# EAGLE board 016-5_spdif-simple_main_revb_sch-pcb (EAGLE 7.7.0)
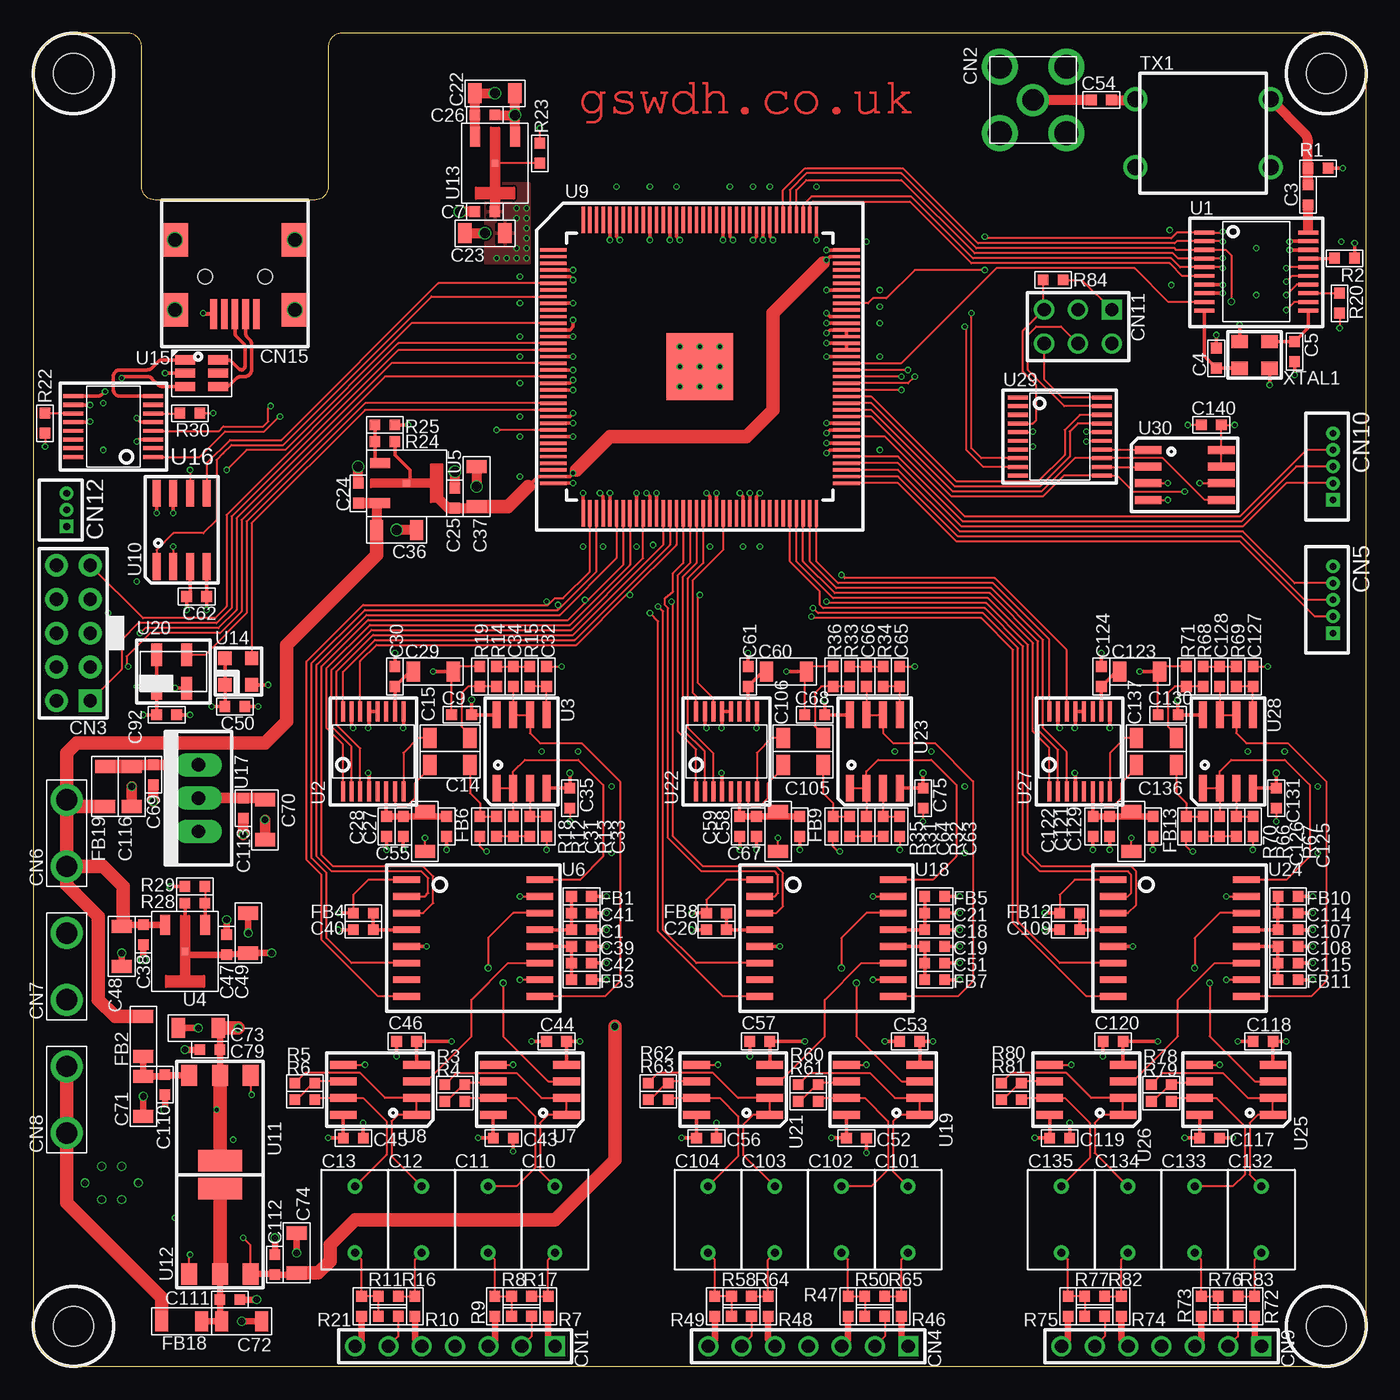
[diagram p10: board, top side]
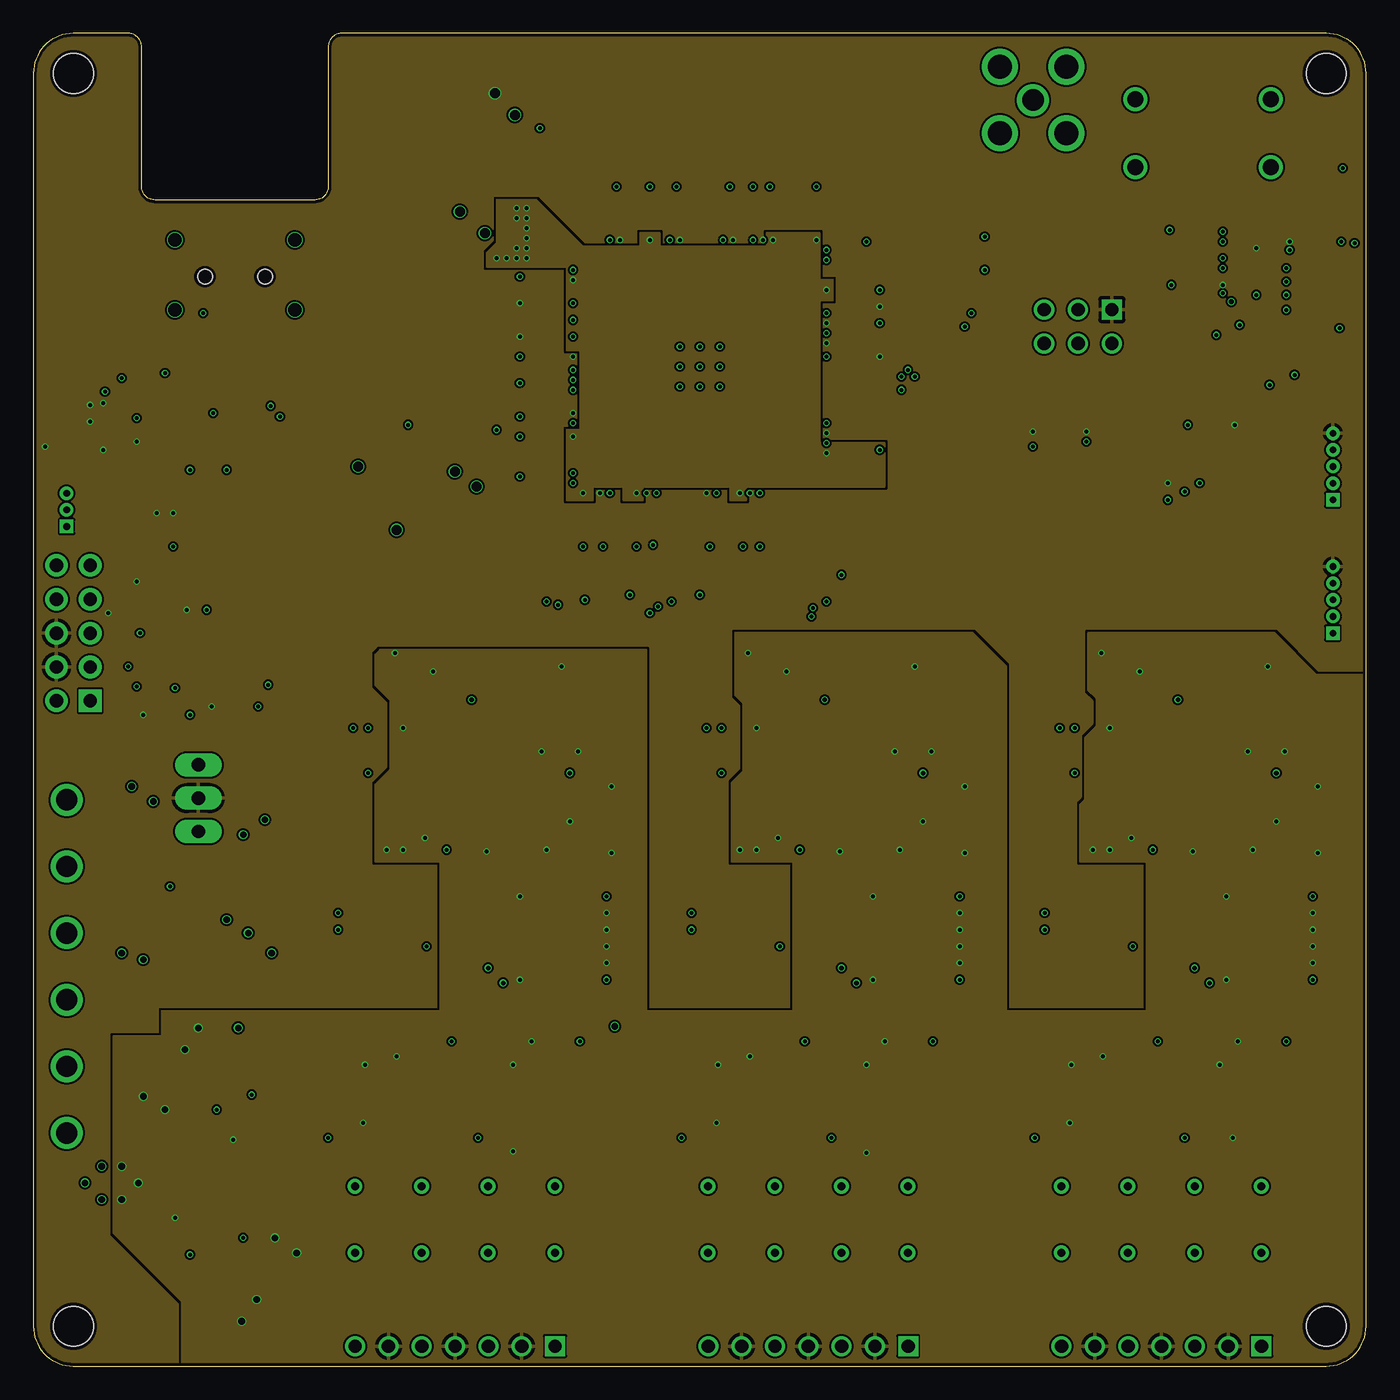
[diagram p11: board, inner layer PWR]
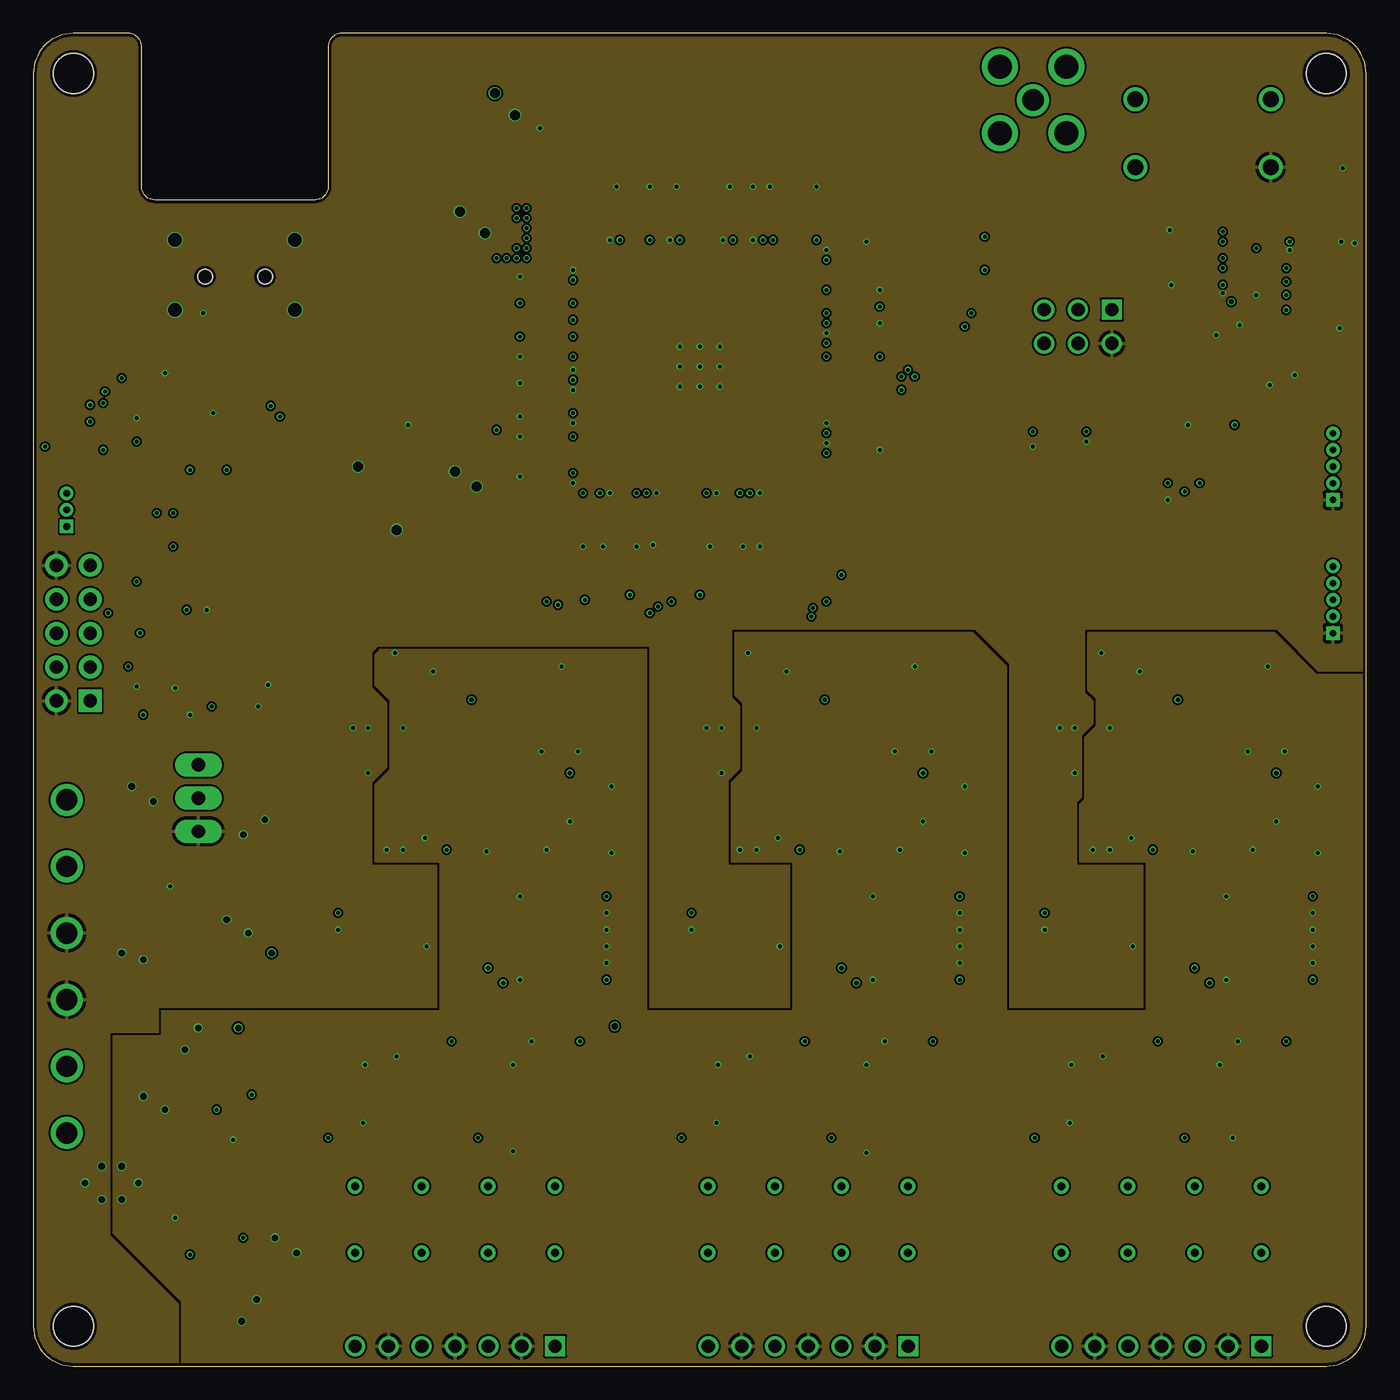
[diagram p12: board, inner layer GND]
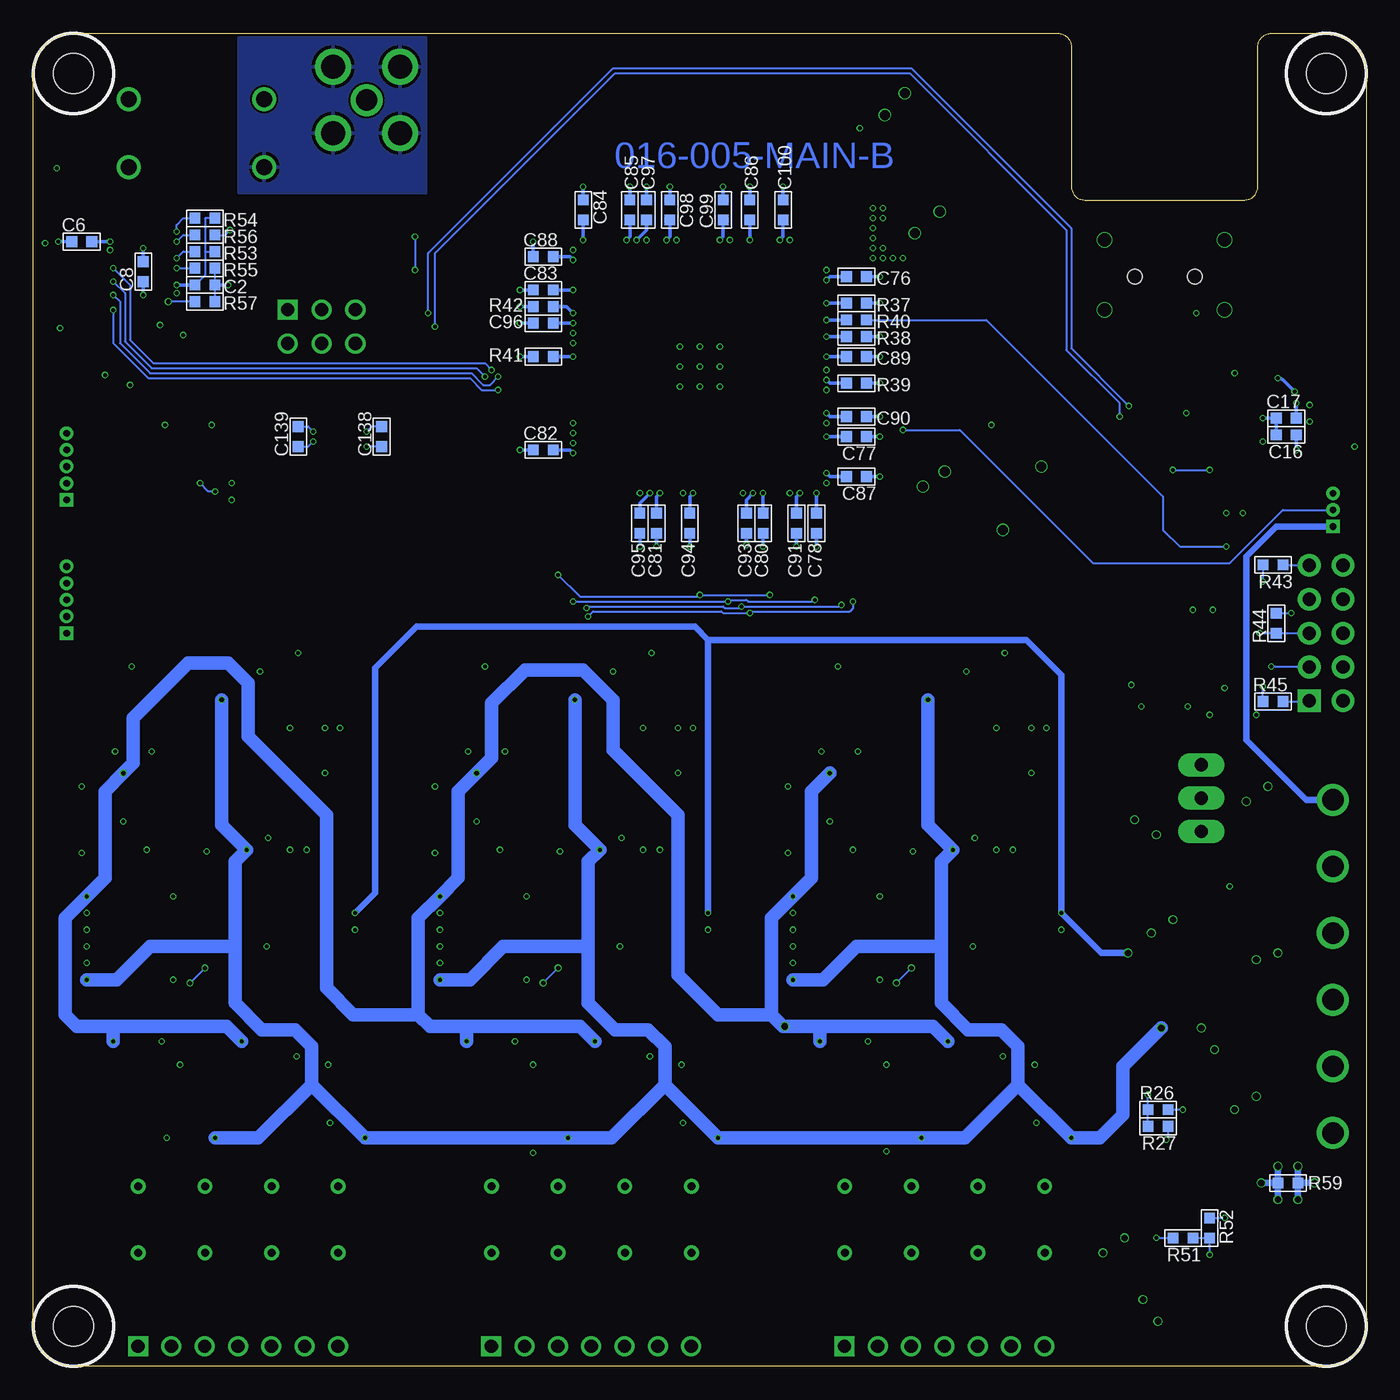
[diagram p13: board, bottom side, seen from below]

Size 100 x 100 mm. Coordinates in mm from the lower left corner, seen from the top.
Outline: 97,0 arc90 100,3 100,97 arc90 97,100 23.12,100 arc90 22.12,99 22.12,88.5 arc-90 21.12,87.5 9.12,87.5 arc-90 8.12,88.5 8.12,99 arc90 7.12,100 3,100 arc90 0,97 0,3 arc90 3,0 97,0
Copper layers (1*2*3*16): Top 0.035mm / dielectric 1.5mm / PWR 0.035mm / dielectric 0.15mm / GND 0.035mm / dielectric 0.2mm / Bottom 0.035mm
Design rules "myDRC 4 layers 0.25mm *": minimum track width 0.15mm, minimum drill 0.3mm, track to track 0.15mm, track to pad 0.15mm, pad to pad 0.15mm, via to via 0.15mm, smd to smd 0mil, copper to edge 0.25mm, drill to drill 0.3mm, minimum pad ring 10mil, minimum via ring 3mil, stop-mask expansion 4mil, vias tented up to drill 0.3mm, thermal gap 10mil

## Footprints (pad centres in the part's own frame; a part is rotated, then mirrored left to right if it is on the bottom)
0603 = smd 0.8 x 0.8: 1 -0.75,0; 2 0.75,0
5X7.2BOX = drill 0.6: 1 -2.5,0; 2 2.5,0
1206 = smd 1 x 1.5: 1 1.5,0; 2 -1.5,0
7PIN_HEADER = drill 1 pad 1.5 square: 1 0,7.52 | drill 1 pad 1.5: 2 0,5.02; 3 0,2.52; 4 0,0.02; 5 0,-2.48; 6 0,-4.98; 7 0,-7.48
SMAVERTICAL = drill 1.6: 1 0,0 | drill 1.8: 2 -2.5,2.5; 3 2.5,2.5; 4 -2.5,-2.5; 5 2.5,-2.5
5X2_2.54MMHEADER = drill 1 pad 1.7 square: 1 -1.27,5.08 | drill 1 pad 1.7: 2 -1.27,2.54; 3 -1.27,0; 4 -1.27,-2.54; 5 -1.27,-5.08; 6 1.27,-5.08; 7 1.27,-2.54; 8 1.27,0; 9 1.27,2.54; 10 1.27,5.08
MOLEX_530470510 = drill 0.5 square: 1 2.5,0 | drill 0.5: 2 1.25,0; 3 0,0; 4 -1.25,0; 5 -2.5,0
6.35MM_TERMINAL = drill 1.6: 1 -2.5,0; 2 2.5,0
2X3HEADER = drill 1 pad 1.5 square: 1 -1.27,2.54 | drill 1 pad 1.5: 2 -1.27,0; 3 -1.27,-2.54; 4 1.27,-2.54; 5 1.27,0; 6 1.27,2.54
MOLEX_530470310 = drill 0.5 square: 1 1.25,0 | drill 0.5: 2 0,0; 3 -1.25,0
MUSB-05-S-B-SM-A = smd 0.5 x 2.25: D+ 0,2.8; D- -0.8,2.8; GND 1.6,2.8; ID 0.8,2.8; VCC -1.6,2.8 | smd 2 x 2.5: SHIELD1 -4.5,2.5; SHIELD2 4.5,2.5; SHIELD3 4.5,-2.75; SHIELD4 -4.5,-2.75 | hole 1.1: 2.25,0; -2.25,0
MOUNTHOLE_6X3 = hole 3: 0,0
DA10XC = drill 1.2: 1 -5.08,2.54; 3 -5.08,-2.54; 4 5.08,-2.54; 6 5.08,2.54
SSOP20-5MM = smd 1.5 x 0.3: 1 -3.9,2.925; 2 -3.9,2.275; 3 -3.9,1.625; 4 -3.9,0.975; 5 -3.9,0.325; 6 -3.9,-0.325; 7 -3.9,-0.975; 8 -3.9,-1.625; 9 -3.9,-2.275; 10 -3.9,-2.925; 11 3.9,-2.925; 12 3.9,-2.275; 13 3.9,-1.625; 14 3.9,-0.975; 15 3.9,-0.325; 16 3.9,0.325; 17 3.9,0.975; 18 3.9,1.625; 19 3.9,2.275; 20 3.9,2.925
SSOP16-4MM@1 = smd 1.5 x 0.3: 1 -3,2.275; 2 -3,1.625; 3 -3,0.975; 4 -3,0.325; 5 -3,-0.325; 6 -3,-0.975; 7 -3,-1.625; 8 -3,-2.275; 9 3,-2.275; 10 3,-1.625; 11 3,-0.975; 12 3,-0.325; 13 3,0.325; 14 3,0.975; 15 3,1.625; 16 3,2.275
SO8 = smd 2 x 0.6: 1 -2.75,2; 2 -2.75,0.75; 3 -2.75,-0.5; 4 -2.75,-1.75; 5 2.75,-1.75; 6 2.75,-0.5; 7 2.75,0.75; 8 2.75,2
SOT89 = smd 0.75 x 1.5: 1 -1.5,-2.25; 3 1.5,-2.25 | smd 0.5 x 0.5: 2 0,-0.25
SOL16 = smd 2 x 0.5: 1 -5,4.375; 2 -5,3.125; 3 -5,1.875; 4 -5,0.625; 5 -5,-0.625; 6 -5,-1.875; 7 -5,-3.125; 8 -5,-4.375; 9 5,-4.375; 10 5,-3.125; 11 5,-1.875; 12 5,-0.625; 13 5,0.625; 14 5,1.875; 15 5,3.125; 16 5,4.375
QFP144_PP = smd 2 x 0.25: 1 -11,8.75; 2 -11,8.25; 3 -11,7.75; 4 -11,7.25; 5 -11,6.75; 6 -11,6.25; 7 -11,5.75; 8 -11,5.25; 9 -11,4.75; 10 -11,4.25; 11 -11,3.75; 12 -11,3.25; 13 -11,2.75; 14 -11,2.25; 15 -11,1.75; 16 -11,1.25; 17 -11,0.75; 18 -11,0.25; 19 -11,-0.25; 20 -11,-0.75; 21 -11,-1.25; 22 -11,-1.75; 23 -11,-2.25; 24 -11,-2.75; 25 -11,-3.25; 26 -11,-3.75; 27 -11,-4.25; 28 -11,-4.75; 29 -11,-5.25; 30 -11,-5.75; 31 -11,-6.25; 32 -11,-6.75; 33 -11,-7.25; 34 -11,-7.75; 35 -11,-8.25; 36 -11,-8.75; 73 11,-8.75; 74 11,-8.25; 75 11,-7.75; 76 11,-7.25; 77 11,-6.75; 78 11,-6.25; 79 11,-5.75; 80 11,-5.25; 81 11,-4.75; 82 11,-4.25; 83 11,-3.75; 84 11,-3.25; 85 11,-2.75; 86 11,-2.25; 87 11,-1.75; 88 11,-1.25; 89 11,-0.75; 90 11,-0.25; 91 11,0.25; 92 11,0.75; 93 11,1.25; 94 11,1.75; 95 11,2.25; 96 11,2.75; 97 11,3.25; 98 11,3.75; 99 11,4.25; 100 11,4.75; 101 11,5.25; 102 11,5.75; 103 11,6.25; 104 11,6.75; 105 11,7.25; 106 11,7.75; 107 11,8.25; 108 11,8.75 | smd 0.25 x 2: 37 -8.75,-11; 38 -8.25,-11; 39 -7.75,-11; 40 -7.25,-11; 41 -6.75,-11; 42 -6.25,-11; 43 -5.75,-11; 44 -5.25,-11; 45 -4.75,-11; 46 -4.25,-11; 47 -3.75,-11; 48 -3.25,-11; 49 -2.75,-11; 50 -2.25,-11; 51 -1.75,-11; 52 -1.25,-11; 53 -0.75,-11; 54 -0.25,-11; 55 0.25,-11; 56 0.75,-11; 57 1.25,-11; 58 1.75,-11; 59 2.25,-11; 60 2.75,-11; 61 3.25,-11; 62 3.75,-11; 63 4.25,-11; 64 4.75,-11; 65 5.25,-11; 66 5.75,-11; 67 6.25,-11; 68 6.75,-11; 69 7.25,-11; 70 7.75,-11; 71 8.25,-11; 72 8.75,-11; 109 8.75,11; 110 8.25,11; 111 7.75,11; 112 7.25,11; 113 6.75,11; 114 6.25,11; 115 5.75,11; 116 5.25,11; 117 4.75,11; 118 4.25,11; 119 3.75,11; 120 3.25,11; 121 2.75,11; 122 2.25,11; 123 1.75,11; 124 1.25,11; 125 0.75,11; 126 0.25,11; 127 -0.25,11; 128 -0.75,11; 129 -1.25,11; 130 -1.75,11; 131 -2.25,11; 132 -2.75,11; 133 -3.25,11; 134 -3.75,11; 135 -4.25,11; 136 -4.75,11; 137 -5.25,11; 138 -5.75,11; 139 -6.25,11; 140 -6.75,11; 141 -7.25,11; 142 -7.75,11; 143 -8.25,11; 144 -8.75,11 | smd 5 x 5: GND 0,0
SOT223 = smd 1.2 x 1.6: 1 -2.3,-3.2; 2 0,-3.2; 3 2.3,-3.2 | smd 3.3 x 1.6: 4 0,3.2
ASEMB = smd 1 x 1: 1 -1,-1; 2 1,-1; 3 1,1; 4 -1,1
SOT23-6 = smd 0.7 x 1.5: 1 1,1.25; 2 0,1.25; 3 -1,1.25; 4 -1,-1.25; 5 0,-1.25; 6 1,-1.25
SSOP16-4MM = smd 1.5 x 0.3: 1 -3,2.275; 2 -3,1.625; 3 -3,0.975; 4 -3,0.325; 5 -3,-0.325; 6 -3,-0.975; 7 -3,-1.625; 8 -3,-2.275; 9 3,-2.275; 10 3,-1.625; 11 3,-0.975; 12 3,-0.325; 13 3,0.325; 14 3,0.975; 15 3,1.625; 16 3,2.275
TO220 = drill 1 pad 1.75 long: 1 -2.5,0; 2 0,0; 3 2.5,0
5X3.2SEAM = smd 0.8 x 1.7: 1 -1.25,-1.25; 2 1,-1.25; 3 1,1.25; 4 -1.25,1.25
SSOP20-4.5MM = smd 1.5 x 0.3: 1 -3.15,2.925; 2 -3.15,2.275; 3 -3.15,1.625; 4 -3.15,0.975; 5 -3.15,0.325; 6 -3.15,-0.325; 7 -3.15,-0.975; 8 -3.15,-1.625; 9 -3.15,-2.275; 10 -3.15,-2.925; 11 3.15,-2.925; 12 3.15,-2.275; 13 3.15,-1.625; 14 3.15,-0.975; 15 3.15,-0.325; 16 3.15,0.325; 17 3.15,0.975; 18 3.15,1.625; 19 3.15,2.275; 20 3.15,2.925
3.2X3.5SMD = smd 1.25 x 1: 1 -1.125,-1; 2 1.125,-1; 3 1.125,1; 4 -1.125,1

## Placement (x,y rotation side)
C1  100nF 50V  [0603]  41.12,32.75 180 top
C2  100nF 50V  [0603]  87.12,81.12 180 bottom
C3  100nF 50V  [0603]  95.62,87.88 270 top
C4  18pF 50V  [0603]  88.75,75.62 270 top
C5  18pF 50V  [0603]  94.62,76.12 90 top
C6  100nF 50V  [0603]  96.38,84.38 0 bottom
C7  100nF 50V  [0603]  33.88,86.62 0 top
C8  1uF 25V  [0603]  91.75,82.12 90 bottom
C9  100nF 50V  [0603]  32.12,48.88 0 top
C10  2.2uF 50V  [5X7.2BOX]  39.12,11 270 top
C11  2.2uF 50V  [5X7.2BOX]  34.12,11 270 top
C12  2.2uF 50V  [5X7.2BOX]  29.12,11 270 top
C13  2.2uF 50V  [5X7.2BOX]  24.12,11 270 top
C14  330nF 16V  [1206]  31.25,45.12 180 top
C15  330nF 16V  [1206]  31.25,47.12 180 top
C16  100nF 50V  [0603]  6,69.88 0 bottom
C17  2.2uF 25V  [0603]  6,71.12 0 bottom
C18  100nF 50V  [0603]  67.62,32.75 180 top
C19  100nF 50V  [0603]  67.62,31.5 180 top
C20  100nF 50V  [0603]  51.25,32.75 0 top
C21  4.7uF 6.3V  [0603]  67.62,34 180 top
C22  10uF 16V  [1206]  34.62,95.5 0 top
C23  10uF 16V  [1206]  33.88,85 180 top
C24  100nF 50V  [0603]  24.38,65.5 270 top
C25  100nF 50V  [0603]  31.62,65.12 270 top
C26  100nF 50V  [0603]  33.88,93.88 180 top
C27  100nF 50V  [0603]  27.75,40.5 90 top
C28  100pF 50V  [0603]  26.5,40.5 90 top
C29  10uF 16V  [1206]  30,52.12 0 top
C30  100nF 50V  [0603]  27.12,51.75 270 top
C31  470pF 16V  [0603]  36,40.5 270 top
C32  470pF 16V  [0603]  38.5,51.75 90 top
C33  470pF 16V  [0603]  38.5,40.5 270 top
C34  470pF 16V  [0603]  36,51.75 90 top
C35  100nF 50V  [0603]  40.25,42.62 270 top
C36  10uF 16V  [1206]  27.25,62.75 0 top
C37  10uF 16V  [1206]  33.25,66 90 top
C38  100nF 50V  [0603]  8.25,32.38 90 top
C39  100nF 50V  [0603]  41.12,31.5 180 top
C40  100nF 50V  [0603]  24.75,32.75 0 top
C41  4.7uF 6.3V  [0603]  41.12,34 180 top
C42  4.7uF 6.3V  [0603]  41.12,30.25 180 top
C43  100nF 50V  [0603]  35.25,17.12 180 top
C44  100nF 50V  [0603]  39.25,24.38 180 top
C45  100nF 50V  [0603]  24,17.12 180 top
C46  100nF 50V  [0603]  28,24.38 180 top
C47  100nF 50V  [0603]  14.5,31.62 270 top
C48  10uF 16V  [1206]  6.62,31.5 270 top
C49  10uF 16V  [1206]  16.12,32.5 90 top
C50  100nF 50V  [0603]  15.12,49.5 180 top
C51  4.7uF 6.3V  [0603]  67.62,30.25 180 top
C52  100nF 50V  [0603]  61.75,17.12 180 top
C53  100nF 50V  [0603]  65.75,24.38 180 top
C54  10nF 50V  [0603]  80.12,95 0 top
C55  10uF 16V  [1206]  29.38,40.12 270 top
C56  100nF 50V  [0603]  50.5,17.12 180 top
C57  100nF 50V  [0603]  54.5,24.38 180 top
C58  100nF 50V  [0603]  54.25,40.5 90 top
C59  100pF 50V  [0603]  53,40.5 90 top
C60  10uF 16V  [1206]  56.5,52.12 0 top
C61  100nF 50V  [0603]  53.62,51.75 270 top
C62  100nF 50V  [0603]  12.25,57.75 180 top
C63  470pF 16V  [0603]  65,40.5 270 top
C64  470pF 16V  [0603]  62.5,40.5 270 top
C65  470pF 16V  [0603]  65,51.75 90 top
C66  470pF 16V  [0603]  62.5,51.75 90 top
C67  10uF 16V  [1206]  55.88,40.12 270 top
C68  100nF 50V  [0603]  58.62,48.88 0 top
C69  10uF 16V  [1206]  7.38,43.5 270 top
C70  10uF 16V  [1206]  17.38,41 270 top
C71  10uF 16V  [1206]  8.25,20.25 270 top
C72  10uF 16V  [1206]  15.62,3.38 180 top
C73  10uF 16V  [1206]  12.38,25.38 180 top
C74  10uF 16V  [1206]  19.75,8.5 270 top
C75  100nF 50V  [0603]  66.75,42.62 270 top
C76  100nF 50V  [0603]  38.25,81.75 180 bottom
C77  100nF 50V  [0603]  38.25,69.75 180 bottom
C78  100nF 50V  [0603]  41.25,63.25 90 bottom
C79  100nF 50V  [0603]  13.25,23.75 0 top
C80  100nF 50V  [0603]  45.25,63.25 90 bottom
C81  100nF 50V  [0603]  53.25,63.25 90 bottom
C82  100nF 50V  [0603]  61.75,68.75 0 bottom
C83  100nF 50V  [0603]  61.75,80.75 0 bottom
C84  100nF 50V  [0603]  58.75,86.75 270 bottom
C85  100nF 50V  [0603]  55.25,86.75 270 bottom
C86  100nF 50V  [0603]  46.25,86.75 270 bottom
C87  100nF 50V  [0603]  38.25,66.75 180 bottom
C88  100nF 50V  [0603]  61.75,83.25 0 bottom
C89  100nF 50V  [0603]  38.25,75.75 180 bottom
C90  100nF 50V  [0603]  38.25,71.25 180 bottom
C91  100nF 50V  [0603]  42.75,63.25 90 bottom
C92  100nF 50V  [0603]  10,48.88 180 top
C93  100nF 50V  [0603]  46.5,63.25 90 bottom
C94  100nF 50V  [0603]  50.75,63.25 90 bottom
C95  100nF 50V  [0603]  54.5,63.25 90 bottom
C96  100nF 50V  [0603]  61.75,78.25 0 bottom
C97  100nF 50V  [0603]  54,86.75 270 bottom
C98  100nF 50V  [0603]  52.25,86.75 270 bottom
C99  100nF 50V  [0603]  48.25,86.75 270 bottom
C100  100nF 50V  [0603]  43.75,86.75 270 bottom
C101  2.2uF 50V  [5X7.2BOX]  65.62,11 270 top
C102  2.2uF 50V  [5X7.2BOX]  60.62,11 270 top
C103  2.2uF 50V  [5X7.2BOX]  55.62,11 270 top
C104  2.2uF 50V  [5X7.2BOX]  50.62,11 270 top
C105  330nF 16V  [1206]  57.75,45.12 180 top
C106  330nF 16V  [1206]  57.75,47.12 180 top
C107  100nF 50V  [0603]  94.12,32.75 180 top
C108  100nF 50V  [0603]  94.12,31.5 180 top
C109  100nF 50V  [0603]  77.75,32.75 0 top
C110  100nF 50V  [0603]  9.88,21.12 90 top
C111  100nF 50V  [0603]  14.75,5 0 top
C112  100nF 50V  [0603]  18.12,7.62 90 top
C113  100nF 50V  [0603]  15.75,41.88 90 top
C114  4.7uF 6.3V  [0603]  94.12,34 180 top
C115  4.7uF 6.3V  [0603]  94.12,30.25 180 top
C116  100nF 50V  [0603]  9,44.38 90 top
C117  100nF 50V  [0603]  88.25,17.12 180 top
C118  100nF 50V  [0603]  92.25,24.38 180 top
C119  100nF 50V  [0603]  77,17.12 180 top
C120  100nF 50V  [0603]  81,24.38 180 top
C121  100nF 50V  [0603]  80.75,40.5 90 top
C122  100pF 50V  [0603]  79.5,40.5 90 top
C123  10uF 16V  [1206]  83,52.12 0 top
C124  100nF 50V  [0603]  80.12,51.75 270 top
C125  470pF 16V  [0603]  91.5,40.5 270 top
C126  470pF 16V  [0603]  89,40.5 270 top
C127  470pF 16V  [0603]  91.5,51.75 90 top
C128  470pF 16V  [0603]  89,51.75 90 top
C129  10uF 16V  [1206]  82.38,40.12 270 top
C130  100nF 50V  [0603]  85.12,48.88 0 top
C131  100nF 50V  [0603]  93.25,42.62 270 top
C132  2.2uF 50V  [5X7.2BOX]  92.12,11 270 top
C133  2.2uF 50V  [5X7.2BOX]  87.12,11 270 top
C134  2.2uF 50V  [5X7.2BOX]  82.12,11 270 top
C135  2.2uF 50V  [5X7.2BOX]  77.12,11 270 top
C136  330nF 16V  [1206]  84.25,45.12 180 top
C137  330nF 16V  [1206]  84.25,47.12 180 top
C138  100nF 50V  [0603]  73.88,69.75 90 bottom
C139  100nF 50V  [0603]  80.12,69.75 90 bottom
C140  100nF 50V  [0603]  88.38,70.62 0 top
CN1  1X7_HEADER  [7PIN_HEADER]  31.62,1.5 270 top
CN2  SMAVERTICAL_R  [SMAVERTICAL]  75,95 180 top
CN3  5X2HEADER  [5X2_2.54MMHEADER]  3,55 180 top
CN4  1X7_HEADER  [7PIN_HEADER]  58.12,1.5 270 top
CN5  PICOBLADE_5_TH_V  [MOLEX_530470510]  97.5,57.5 270 top
CN6  6.35MM_TAB_TERMINAL  [6.35MM_TERMINAL]  2.5,40 90 top
CN7  6.35MM_TAB_TERMINAL  [6.35MM_TERMINAL]  2.5,30 90 top
CN8  6.35MM_TAB_TERMINAL  [6.35MM_TERMINAL]  2.5,20 90 top
CN9  1X7_HEADER  [7PIN_HEADER]  84.62,1.5 270 top
CN10  PICOBLADE_5_TH_V  [MOLEX_530470510]  97.5,67.5 270 top
CN11  [2X3HEADER]  78.38,78 270 top
CN12  PICOBLADE_3_TH_V  [MOLEX_530470310]  2.5,64.25 270 top
CN15  MUSB-05-S-B-SM-A  [MUSB-05-S-B-SM-A]  15.12,81.75 180 top
FB1  600R  [0603]  41.12,35.25 180 top
FB2  150R  [1206]  8.25,24.75 90 top
FB3  600R  [0603]  41.12,29 180 top
FB4  600R  [0603]  24.75,34 180 top
FB5  600R  [0603]  67.62,35.25 180 top
FB6  600R  [0603]  31,40.5 270 top
FB7  600R  [0603]  67.62,29 180 top
FB8  600R  [0603]  51.25,34 180 top
FB9  600R  [0603]  57.5,40.5 270 top
FB10  600R  [0603]  94.12,35.25 180 top
FB11  600R  [0603]  94.12,29 180 top
FB12  600R  [0603]  77.75,34 180 top
FB13  600R  [0603]  84,40.5 270 top
FB18  150R  [1206]  11.12,3.38 180 top
FB19  150R  [1206]  5.38,43.5 270 top
MECH1  6mm x 3mm  [MOUNTHOLE_6X3]  97,97 180 top
MECH2  6mm x 3mm  [MOUNTHOLE_6X3]  97,3 180 top
MECH3  6mm x 3mm  [MOUNTHOLE_6X3]  3,3 180 top
MECH4  6mm x 3mm  [MOUNTHOLE_6X3]  3,97 180 top
R1  75R  [0603]  96.38,89.88 180 top
R2  330R  [0603]  98.38,83.12 180 top
R3  1k  [0603]  31.62,21.12 0 top
R4  1k  [0603]  31.62,19.88 0 top
R5  1k  [0603]  20.38,21.25 0 top
R6  1k  [0603]  20.38,20 0 top
R7  39R  [0603]  38.62,4.5 270 top
R8  560k  [0603]  36.62,5.25 0 top
R9  39R  [0603]  34.62,4.5 270 top
R10  39R  [0603]  28.62,4.5 270 top
R11  560k  [0603]  26.62,5.25 0 top
R12  20k0  [0603]  34.75,40.5 270 top
R13  20k0  [0603]  37.25,40.5 90 top
R14  20k0  [0603]  34.75,51.75 90 top
R15  20k0  [0603]  37.25,51.75 270 top
R16  560k  [0603]  26.62,3.75 180 top
R17  560k  [0603]  36.62,3.75 180 top
R18  180k  [0603]  33.5,40.5 90 top
R19  180k  [0603]  33.5,51.75 270 top
R20  10K  [0603]  98,79.75 90 top
R21  39R  [0603]  24.62,4.5 270 top
R22  10K  [0603]  0.88,70.75 270 top
R23  270R  [0603]  38,91 270 top
R24  270R  [0603]  26.38,69.38 0 top
R25  270R  [0603]  26.38,70.62 180 top
R26  110R  [0603]  15.62,19.25 0 bottom
R27  330R  [0603]  15.62,18 180 bottom
R28  110R  [0603]  12.12,34.75 180 top
R29  330R  [0603]  12.12,36 0 top
R30  10K  [0603]  11.75,71.5 180 top
R31  20k0  [0603]  61.25,40.5 270 top
R32  20k0  [0603]  63.75,40.5 90 top
R33  20k0  [0603]  61.25,51.75 90 top
R34  20k0  [0603]  63.75,51.75 270 top
R35  180k  [0603]  60,40.5 90 top
R36  180k  [0603]  60,51.75 270 top
R37  10K  [0603]  38.25,79.75 180 bottom
R38  10K  [0603]  38.25,77.25 180 bottom
R39  10K  [0603]  38.25,73.75 180 bottom
R40  16R  [0603]  38.25,78.5 180 bottom
R41  10K  [0603]  61.75,75.75 0 bottom
R42  10K  [0603]  61.75,79.5 0 bottom
R43  1k  [0603]  7,60.12 180 bottom
R44  1k  [0603]  6.75,55.75 90 bottom
R45  1k  [0603]  7,49.88 0 bottom
R46  39R  [0603]  65.12,4.5 270 top
R47  39R  [0603]  61.12,4.5 270 top
R48  39R  [0603]  55.12,4.5 270 top
R49  39R  [0603]  51.12,4.5 270 top
R50  560k  [0603]  63.12,5.25 0 top
R51  110R  [0603]  13.75,9.62 0 bottom
R52  330R  [0603]  11.75,10.38 90 bottom
R53  10K  [0603]  87.12,83.62 0 bottom
R54  10K  [0603]  87.12,86.12 0 bottom
R55  10K  [0603]  87.12,82.38 0 bottom
R56  10K  [0603]  87.12,84.88 0 bottom
R57  10K  [0603]  87.12,79.88 0 bottom
R58  560k  [0603]  53.12,5.25 0 top
R59  0R  [0603]  5.88,13.75 180 bottom
R60  1k  [0603]  58.12,21.12 0 top
R61  1k  [0603]  58.12,19.88 0 top
R62  1k  [0603]  46.88,21.25 0 top
R63  1k  [0603]  46.88,20 0 top
R64  560k  [0603]  53.12,3.75 180 top
R65  560k  [0603]  63.12,3.75 180 top
R66  20k0  [0603]  87.75,40.5 270 top
R67  20k0  [0603]  90.25,40.5 90 top
R68  20k0  [0603]  87.75,51.75 90 top
R69  20k0  [0603]  90.25,51.75 270 top
R70  180k  [0603]  86.5,40.5 90 top
R71  180k  [0603]  86.5,51.75 270 top
R72  39R  [0603]  91.62,4.5 270 top
R73  39R  [0603]  87.62,4.5 270 top
R74  39R  [0603]  81.62,4.5 270 top
R75  39R  [0603]  77.62,4.5 270 top
R76  560k  [0603]  89.62,5.25 0 top
R77  560k  [0603]  79.62,5.25 0 top
R78  1k  [0603]  84.62,21.12 0 top
R79  1k  [0603]  84.62,19.88 0 top
R80  1k  [0603]  73.38,21.25 0 top
R81  1k  [0603]  73.38,20 0 top
R82  560k  [0603]  79.62,3.75 180 top
R83  560k  [0603]  89.62,3.75 180 top
R84  10K  [0603]  76.5,81.5 180 top
TX1  DA101C  [DA10XC]  87.75,92.5 0 top
U1  WM8804  [SSOP20-5MM]  91.75,82.12 0 top
U2  PCM1754  [SSOP16-4MM@1]  25.5,46.12 90 top
U3  LME49720  [SO8]  36.75,46.12 90 top
U4  LM317  [SOT89]  11.38,30.88 180 top
U5  LM317  [SOT89]  28.25,66.25 270 top
U6  PGA2311  [SOL16]  33,32.12 0 top
U7  LME49720  [SO8]  37.25,20.88 180 top
U8  LME49720  [SO8]  26,20.88 180 top
U9  EP4CE6E22C8N  [QFP144_PP]  50,75 0 top
U10  M25P16  [SO8]  11.25,62.75 90 top
U11  [SOT223]  14,18.62 180 top
U12  [SOT223]  14,10.12 0 top
U13  LM317  [SOT89]  34.62,90 180 top
U14  24.576MHz  [ASEMB]  15.38,52.12 0 top
U15  USBLC6-2SC6  [SOT23-6]  12.62,74.5 90 top
U16  FT230X  [SSOP16-4MM]  6,70.5 180 top
U17  LD1117AV33  [TO220]  12.38,42.62 90 top
U18  PGA2311  [SOL16]  59.5,32.12 0 top
U19  LME49720  [SO8]  63.75,20.88 180 top
U20  100MHz  [5X3.2SEAM]  10.5,52.12 0 top
U21  LME49720  [SO8]  52.5,20.88 180 top
U22  PCM1754  [SSOP16-4MM@1]  52,46.12 90 top
U23  LME49720  [SO8]  63.25,46.12 90 top
U24  PGA2311  [SOL16]  86,32.12 0 top
U25  LME49720  [SO8]  90.25,20.88 180 top
U26  LME49720  [SO8]  79,20.88 180 top
U27  PCM1754  [SSOP16-4MM@1]  78.5,46.12 90 top
U28  LME49720  [SO8]  89.75,46.12 90 top
U29  STM32F030F4  [SSOP20-4.5MM]  77,69.75 0 top
U30  SST26VF016B  [SO8]  86.38,66.75 0 top
U$194  [GSWDH.CO.UK]  40.88,92.62 0 top
XTAL1  ABM8-12.000MHZ-B2-T  [3.2X3.5SMD]  91.62,75.88 180 top

## Tracks (layer width: path | path; a pad name or v marks a point on that pad's centre or on a via)
1V2  (via drill 0.3)
  Top 0.15: R23.2 U13.2
  Top 0.25: C78.2 v41.25,65.5 | C80.2 v45.25,65.5 | C81.2 53.25,65.25 v53,65.5 | C82.2 59.75,68.75 v59.5,68.5 | C83.2 v59.5,80.75 | C84.2 v58.75,84.5 | C85.2 55.25,84.75 v55.5,84.5 | C86.2 v46.25,84.5 | C76.2 40.25,81.75 v40.5,81.5 | C77.2 v40.5,69.75
  Top 0.75: 34.62,87.88 C7.2 U13.2
  Bottom 0.25: C78.2 v41.25,65.5 | C80.2 v45.25,65.5 | C81.2 53.25,65.25 v53,65.5 | C82.2 59.75,68.75 v59.5,68.5 | C83.2 v59.5,80.75 | C84.2 v58.75,84.5 | C85.2 55.25,84.75 v55.5,84.5 | C86.2 v46.25,84.5 | C76.2 40.25,81.75 v40.5,81.5 | C77.2 v40.5,69.75
  other vias: 37,83.12 36.25,83.12 35.5,83.12 34.75,83.12 36.25,83.88 37,83.88 37,84.62 37,85.38 37,86.12 36.25,86.12 37,86.88 36.25,86.88
  pour PWR (isolate 0.15, rank 5): 40,70.25 40,65 42,65 42,66 44.25,66 44.25,65 45.75,65 45.75,66 52.25,66 52.25,65 53.5,65 53.5,66 63.88,66 63.88,69.25 59,69.25 59,80 60,80 60,81.5 59,81.5 59,85 55,85 55,84 47,84 47,85 45.5,85 45.5,84 41.25,84 37.75,87.5 34.75,87.5 34.75,84.25 34,83.5 34,82.5 40,82.5 40,76.25 41,76.25 41,70.25
  pour Top: 37.25,88.75 33.88,88.75 33.88,82.75 37.25,82.75
2V5  (via drill 0.3)
  Top 0.25: C88.2 59.75,83.25 v59.5,83 59.25,82.75 | 40.75,67.25 v40.5,67 40.25,66.75 C87.2 37.88,66.75 37.12,66 | R24.2 27.12,68.38 28.25,67.25 28.25,66.25 U5.2 30.25,66.25
  Top 0.75: C37.2 33.12,64.38 C25.2 31.12,64.38 30.25,65.25 30.25,66.25
  Top 1: 59.25,82.75 55.5,79 55.5,71.75 53.5,69.75 43.25,69.75 40.75,67.25 | 37.12,66 35.62,64.5 C37.2
  Bottom 0.25: C88.2 59.75,83.25 v59.5,83 | C87.2 40.25,66.75 v40.5,67
3V3  (via drill 0.3, 0.75)
  Top 0.15: U29.16 79.05,70.08 v79,70.12 | U29.5 74.95,70.08 v75,70.12 | U30.7 U30.8 C140.2 v90.12,70.62 | U30.3 v85.12,66.25 | R84.1 78.69,81.5 CN11.1 | R22.2 v0.88,69
  Top 0.25: C91.2 42.75,65.25 v42.5,65.5 | U9.47 46.25,65.25 v46,65.5 | C94.2 50.75,65.25 v50.5,65.5 | U9.62 v53.75,65.5 | U9.81 59.75,70.25 v59.5,70 | U9.93 U9.94 v59.5,76.75 | U9.97 v59.5,78.25 | U9.117 v54.75,84.5 | C98.2 52.25,84.75 v52.5,84.5 | C99.2 48.25,84.75 v48.5,84.5 | C100.2 43.75,84.75 v44,84.5 | C89.2 v40.5,75.75 | C90.2 40.25,71.25 v40.5,71.5 | U10.3 11.75,57.75 C62.2 v11.5,56.75 | U10.7 v10.5,64 | v9.25,64 U10.8 | U1.7 89.1,81.15 89.12,81.12 v89.25,81.12 | U1.19 94.28,84.4 v94.25,84.38 | U20.4 U20.1 C92.2 v8.25,48.88 | v13.38,49.5 C50.2 U14.1 U14.4 | U16.10 v4.25,72.12 | U16.12 4.2,70.83 v4.25,70.88 | U16.3 7.9,69.53 v7.75,69.38
  Top 0.75: v34.62,95.5 C22.2 C26.2 U13.3
  Top 0.8: U17.2 C113.2 17.25,42.62 C70.2
  Bottom 0.15: R43.2 v7.75,58.88 | R44.2 v5.62,56.5 | C138.2 74.62,70.5 v75,70.12 | C139.2 79.38,70.5 v79,70.12
  Bottom 0.152: 87.75,81.12 C2.2 87.12,81.88 87.12,83.62 | 87.12,83.62 R53.2 | R54.2 87.12,86.12 87.12,83.62
  Bottom 0.25: C91.2 42.75,65.25 v42.5,65.5 | C93.2 46.5,65 v46,65.5 | C94.2 50.75,65.25 v50.5,65.5 | C95.2 54.5,64.75 v53.75,65.5 | U9.97 v59.5,78.25 | C97.2 54,85.25 v54.75,84.5 | C98.2 52.25,84.75 v52.5,84.5 | C99.2 48.25,84.75 v48.5,84.5 | C100.2 43.75,84.75 v44,84.5 | C89.2 v40.5,75.75 | C90.2 40.25,71.25 v40.5,71.5 | R41.1 v63.5,75.75 | R42.1 v63.5,79.5 | R38.1 v36.5,77.25 | R37.1 v36.5,79.75 | C2.2 v89.25,81.12 | C6.2 v94.25,84.38 | C8.2 v91.75,83.88 | C17.2 v5.25,72.25 | C16.2 v5.25,68.75
  pour PWR (rank 6): 0,0 100,0 100,100 0,100
5V  (via drill 0.3, 0.5)
  Top 0.15: U6.1 25.12,36.5 24,35.38 FB4.2 | U24.1 78.12,36.5 77,35.38 FB12.2 | U18.1 52,36.5 50.5,35 FB8.2
  Top 0.25: FB4.2 v22.88,34 | U4.2 R28.2 | FB8.2 v49.38,34 | FB12.2 v75.88,34
  Top 0.5: U4.2 11.62,30.88 C47.2 C49.2 v17.88,31
  Bottom 0.5: v17.88,31 19.88,31 v22.88,34 22.88,51.88 25.5,54.5 49.38,54.5 | 49.38,54.5 50.38,55.5 71.25,55.5 74.38,52.38 74.38,35.5 v75.88,34 | v49.38,34 49.38,54.5
+5V  (via drill 0.3, 0.35, 0.5)
  Top 0.15: 14,21.62 14,19.5 v13.75,19.25
  Top 0.25: U7.8 C43.2 v33.38,17.12 | U8.8 C45.2 v22.12,17.12 | FB6.2 v31,38.75 | FB3.1 v43,29 | U3.8 C9.2 v32.88,50 | U19.8 C52.2 v59.88,17.12 | U21.8 C56.2 v48.62,17.12 | FB9.2 v57.5,38.75 | FB7.1 v69.5,29 | U23.8 C68.2 v59.38,50 | U25.8 C117.2 v86.38,17.12 | U26.8 C119.2 v75.12,17.12 | FB13.2 v84,38.75 | FB11.1 v96,29 | U28.8 C130.2 v85.88,50
  Top 0.5: 14,21.75 U11.2 C79.2 14,25.25 C73.2
  Top 1: U11.4 14,21.62 14,21.75 | C73.2 v15.38,25.38
  Bottom 0.15: v13.75,19.25 R26.2
  Bottom 1: v32.88,50 32.88,40.62 v31,38.75 31.88,37.88 31.88,31.5 | v43,29 40.75,29 38.25,31.5 31.88,31.5 | 31.88,31.5 31.88,27.25 29.88,25.25 27.38,25.25 26.12,24 26.12,21.12 | 26.12,21.12 30.12,17.12 v33.38,17.12 v48.62,17.12 52.62,21.12 | 26.12,21.12 v22.12,17.12 20,17.12 18.25,18.88 18.25,22.5 v15.38,25.38 | v59.38,50 59.38,40.62 v57.5,38.75 58.38,37.88 58.38,31.5 | v69.5,29 67.25,29 64.75,31.5 58.38,31.5 | 58.38,31.5 58.38,27.25 56.38,25.25 53.88,25.25 52.62,24 52.62,21.12 | 52.62,21.12 56.62,17.12 v59.88,17.12 v75.12,17.12 79.12,21.12 | v85.88,50 85.88,40.62 v84,38.75 84.88,37.88 84.88,31.5 | v96,29 93.75,29 91.25,31.5 84.88,31.5 | 84.88,31.5 84.88,27.25 82.88,25.25 80.38,25.25 79.12,24 79.12,21.12 | 79.12,21.12 83.12,17.12 v86.38,17.12
-5V  (via drill 0.3, 0.35, 0.5)
  Top 0.15: U12.3 16.3,9.07 v15.75,9.62
  Top 0.25: U8.4 C46.1 v31.38,24.38 | U7.4 C44.1 v41,24.38 | FB1.1 v43,35.25 | U3.4 C35.1 v40.25,44.5 | U21.4 C57.1 v57.88,24.38 | U19.4 C53.1 v67.5,24.38 | FB5.1 v69.5,35.25 | U23.4 C75.1 v66.75,44.5 | U26.4 C120.1 v84.38,24.38 | U25.4 C118.1 v94,24.38 | FB10.1 v96,35.25 | U28.4 C131.1 v93.25,44.5
  Top 0.5: U12.3 18.07,6.92 C112.1 19.62,6.88 C74.1
  Top 1: C74.1 21.38,7 22.25,7.88 22.25,9.12 24.12,11 39.12,11 43.62,15.5 v43.62,25.5
  Bottom 0.15: v15.75,9.62 R51.1
  Bottom 1: 44.62,26.38 44.62,33.62 v43,35.25 41.62,36.62 41.62,43.12 v40.25,44.5 | 44.62,26.38 43.75,25.5 v43.62,25.5 41,25.5 | v31.38,24.38 32.5,25.5 41,25.5 | 71.12,26.38 71.12,33.62 v69.5,35.25 68.12,36.62 68.12,43.12 v66.75,44.5 65.62,45.62 65.62,49.75 63.12,52.25 58.75,52.25 56.5,50 56.5,46.25 51.62,41.38 51.62,29.38 48.62,26.38 44.62,26.38 | 71.12,26.38 70.25,25.5 67.5,25.5 | v57.88,24.38 59,25.5 67.5,25.5 | v67.5,24.38 67.5,25.5 | v84.38,24.38 85.5,25.5 94,25.5 | 94,25.5 96.75,25.5 97.62,26.38 97.62,33.62 v96,35.25 94.62,36.62 94.62,43.12 v93.25,44.5 92.5,45.25 92.5,48.62 88.38,52.75 85.38,52.75 83.88,51.25 83.88,47.25 78,41.38 78,28.38 76,26.38 71.12,26.38 | v94,24.38 94,25.5 | 41,25.5 v41,24.38
AGND  (via drill 0.3, 0.5)
  Top 0.15: C33.2 v38.5,38.75 | v34,38.62 33.88,38.62 33.5,39 R18.1 | C32.2 v39.62,52.5 | U7.5 v36,22.62 | U8.5 v24.88,22.62 | U6.10 v36.5,29 | v36.5,35.25 U6.15 | C63.2 v65,38.75 | v60.5,38.62 60.38,38.62 60,39 R35.1 | C65.2 v66.12,52.5 | U19.5 v62.5,22.62 | U21.5 v51.38,22.62 | U18.10 v63,29 | v63,35.25 U18.15 | C125.2 v91.5,38.75 | v87,38.62 86.88,38.62 86.5,39 R70.1 | C127.2 v92.62,52.5 | U25.5 v89,22.62 | U26.5 v77.88,22.62 | U24.10 v89.5,29 | v89.5,35.25 U24.15 | C68.1 57.88,52 C60.1 58.38,52.5 R36.1 | C9.1 31.38,52 C29.1 31.88,52.5 R19.1 | C130.1 84.38,52 C123.1 84.88,52.5 R71.1 | C67.1 v55.88,39.62 | C129.1 v82.38,39.62 | C55.1 v29.38,39.62 | C35.2 v40.25,40.88 | C75.2 v66.75,40.88 | C131.2 v93.25,40.88 | R83.1 90.38,2.23 CN9.2 | R82.1 80.38,2.23 CN9.6 | R65.1 63.88,2.23 CN4.2 | R64.1 53.88,2.23 CN4.6 | R17.1 37.38,2.23 CN1.2 | R16.1 27.38,2.23 CN1.6
  Top 0.25: C28.1 v26.5,38.75 | v27.75,38.75 C27.1 | U2.9 27.77,47.9 v27.75,47.88 | C30.1 v27.12,53.5 | C29.1 v30,52.12 | C43.1 v36,16.12 | C45.1 v24.75,18.25 | C46.2 v27.25,23.25 | C44.2 v37.38,24.38 | C42.1 v43,30.25 | v43,31.5 C39.1 | C1.1 v43,32.75 | v43,34 C41.1 | C59.1 v53,38.75 | v54.25,38.75 C58.1 | U22.9 54.27,47.9 v54.25,47.88 | C61.1 v53.62,53.5 | C60.1 v56.5,52.12 | C52.1 v62.5,16 | C56.1 v51.25,18.25 | C57.2 v53.75,23.25 | C53.2 v63.88,24.38 | C51.1 v69.5,30.25 | v69.5,31.5 C19.1 | C18.1 v69.5,32.75 | v69.5,34 C21.1 | C122.1 v79.5,38.75 | v80.75,38.75 C121.1 | U27.9 80.78,47.9 v80.75,47.88 | C124.1 v80.12,53.5 | C123.1 v83,52.12 | C117.1 v90,17.12 | C119.1 v77.75,18.25 | C120.2 v80.25,23.25 | C118.2 v90.38,24.38 | C115.1 v96,30.25 | v96,31.5 C108.1 | C107.1 v96,32.75 | v96,34 C114.1
  Top 0.5: C79.1 v11.38,23.75 | C73.1 v12.38,25.38 | C110.1 v9.88,19.25 | C71.1 v8.25,20.25 | C111.2 v16.75,5 | C72.2 v15.62,3.38 | C112.2 v18.12,9.62 | C74.2 v19.75,8.5
  Bottom 0.15: R27.1 14.88,17.12 v15,17 | R52.2 v10.62,11.12
  Bottom 0.5: R59.2 v6.62,15 | R59.2 v7.88,13.75 | R59.2 v6.62,12.5
  other vias: 38.12,46.12 40.88,46.12 43.38,43.5 43.38,38.5 64.62,46.12 67.38,46.12 69.88,43.5 69.88,38.5 91.12,46.12 93.88,46.12 96.38,43.5 96.38,38.5
  pour PWR: 11.12,0 100,0 100,51.88 96.25,51.88 93.12,55 79.12,55 79.12,50.75 79.75,50.12 79.75,48 78.88,47.12 78.88,42.5 78.5,42.12 78.5,37.88 83.5,37.88 83.5,26.62 73,26.62 73,52.5 70.5,55 52.62,55 52.62,50.38 53.25,49.75 53.25,44.62 52.38,43.75 52.38,37.88 57,37.88 57,26.62 46,26.62 46,53.75 26,53.75 25.62,53.38 25.62,51.12 26.75,50 26.75,44.75 25.62,43.62 25.62,37.88 30.5,37.88 30.5,26.62 9.62,26.62 9.62,24.75 6,24.75 6,10 11.12,4.88
  pour GND: 11.12,0 100,0 100,51.88 96.25,51.88 93.12,55 79.12,55 79.12,50.75 79.75,50.12 79.75,48 78.88,47.12 78.88,42.5 78.5,42.12 78.5,37.88 83.5,37.88 83.5,26.62 73,26.62 73,52.5 70.5,55 52.62,55 52.62,50.38 53.25,49.75 53.25,44.62 52.38,43.75 52.38,37.88 57,37.88 57,26.62 46,26.62 46,53.75 26,53.75 25.62,53.38 25.62,51.12 26.75,50 26.75,44.75 25.62,43.62 25.62,37.88 30.5,37.88 30.5,26.62 9.62,26.62 9.62,24.75 6,24.75 6,10 11.12,4.88
ASDO
  Top 0.15: 14.75,69.5 18.62,69.5 30.38,81.25 U9.6
  Top 0.152: 14.75,69.5 13,67.75 U10.5
CLK_24M576
  Top 0.15: U14.3 16.38,63.25 24.88,71.75 U9.25
CLK_100M
  Top 0.15: U20.3 12.88,53.38 16,56.5 16,63.38 24.88,72.25 U9.24
CONF_DN  (via drill 0.3)
  Top 0.25: v59.5,75.75 R41.2
  Bottom 0.25: R41.2 v59.5,75.75
DAC0_I2S_BCLK
  Top 0.15: U2.1 23.23,46.65 22,47.88 22,52.38 25.25,55.62 40.25,55.62 44.75,60.12 U9.44
DAC0_I2S_DATA
  Top 0.15: U2.2 23.88,46.5 22.38,48 22.38,52.25 25.38,55.25 40.38,55.25 45.75,60.62 U9.46
DAC0_I2S_LRCLK
  Top 0.15: U2.3 24.52,46.35 22.75,48.12 22.75,52.12 25.5,54.88 40.5,54.88 47.25,61.62 U9.49
DAC0_I2S_SCLK
  Top 0.15: U2.16 23.23,52.1 25.62,54.5 40.62,54.5 47.75,61.62 U9.50
DAC1_I2S_BCLK
  Top 0.15: U22.1 49.73,46.27 48.38,47.62 48.38,59.38 49.25,60.25 U9.53
DAC1_I2S_DATA
  Top 0.15: U22.2 50.38,46.12 48.75,47.75 48.75,59.25 49.75,60.25 U9.54
DAC1_I2S_LRCLK
  Top 0.15: U22.3 51.02,45.98 49.12,47.88 49.12,59.12 50.25,60.25 U9.55
DAC1_I2S_SCLK
  Top 0.15: U22.16 49.73,50.27 49.5,50.5 49.5,59 51.75,61.25 U9.58
DAC2_I2S_BCLK
  Top 0.15: U27.1 76.22,46.4 75,47.62 75,54.25 71.62,57.62 60,57.62 57.25,60.38 U9.69
DAC2_I2S_DATA
  Top 0.15: U27.2 76.88,46.25 75.38,47.75 75.38,54.38 71.75,58 60.12,58 57.75,60.38 U9.70
DAC2_I2S_LRCLK
  Top 0.15: U27.3 77.53,46.1 75.75,47.88 75.75,54.5 71.88,58.38 60.25,58.38 58.25,60.38 U9.71
DAC2_I2S_SCLK
  Top 0.15: U27.16 76.22,54.52 72,58.75 60.38,58.75 58.75,60.38 U9.72
DAC_MUTE  (via drill 0.3)
  Top 0.15: U2.14 24.52,52.9 25.75,54.12 40.75,54.12 44.62,58 | v44.75,57.88 44.62,58 | 44.62,58 48.25,61.62 U9.51 | U27.14 77.53,53.73 72.12,59.12 60.88,59.12 v60.62,59.38 | U22.14 51.02,50.1 49.88,51.25 49.88,57.75 v50,57.88
  Bottom 0.15: v60.62,59.38 59,57.75 50.12,57.75 v50,57.88 v44.75,57.88
DATA0  (via drill 0.3)
  Top 0.25: v40.5,78.5 40.5,78 40.25,77.75 U9.13
  Bottom 0.25: R40.2 v40.5,78.5
DCLK  (via drill 0.3)
  Top 0.15: v11.75,67.25 U10.6 | U9.12 28.38,78.25 18.88,68.75 16,68.75 v14.5,67.25
  Bottom 0.15: v14.5,67.25 v11.75,67.25
DISP_SPI_!CE
  Top 0.15: CN10.2 94,66.25 90.75,63 69.62,63 64.88,67.75 U9.76
DISP_SPI_MOSI
  Top 0.15: CN10.3 94.75,67.5 90.62,63.38 69.75,63.38 64.88,68.25 U9.77
DISP_SPI_SCLK
  Top 0.15: CN10.4 95.5,68.75 90.5,63.75 69.88,63.75 63.88,69.75 U9.80
DSP_!CE
  Top 0.15: U29.18 78.5,71.38 77.38,70.25 77.38,68.38 75.38,66.38 69.25,66.38 62.88,72.75 U9.86
DSP_REG_CLK
  Top 0.15: U29.17 78.35,70.72 77.75,70.12 77.75,68.25 75.5,66 69.12,66 62.88,72.25 U9.85
ENC_A
  Top 0.15: CN5.2 96.12,56.25 90.5,61.88 69.25,61.88 64.88,66.25 U9.73
ENC_B
  Top 0.15: CN5.3 95.38,57.5 90.62,62.25 69.38,62.25 64.88,66.75 U9.74
ENC_SW
  Top 0.15: CN5.4 94.62,58.75 90.75,62.62 69.5,62.62 64.88,67.25 U9.75
FLSH_!CE
  Top 0.15: U29.14 83.6,68.78 U30.1
GND  (via drill 0.3, 0.5, 0.75, 1)
  Top 0.15: R20.1 v98,77.88 | R23.1 v38,92.88 | U29.15 79.05,69.42 v79,69.38 | C140.1 v86.62,70.62 | U30.4 v85.12,65 | R30.1 v13.5,71.5
  Top 0.25: C4.1 v88.75,77.38 | XTAL1.4 v92.75,73.62 | XTAL1.2 v90.5,78.12 | v94.62,74.38 C5.1 | R1.1 v98.25,89.88 | R2.1 v99.12,84.25 | U1.8 v89.25,80.5 | U1.18 v94.25,83.75 | v25.12,47.88 25.18,47.92 U2.13 U2.12 | U2.15 23.88,48 v24,47.88 | U2.4 25.18,44.45 v25.12,44.5 | U9.36 v40.5,66.25 | U9.41 v43.25,65.5 | U9.48 v46.75,65.5 | U9.57 v51.25,65.5 | U9.63 54.25,65.25 v54.5,65.5 | U9.79 v59.5,69.25 | U9.82 v59.5,70.75 | U9.95 U9.96 59.75,77.75 v59.5,77.5 | U9.108 v59.5,83.75 | U9.118 54.25,84.75 v54,84.5 | U9.123 v51.75,84.5 | U9.131 v47.75,84.5 | U9.140 v43.25,84.5 | U9.4 v40.5,82.25 | U9.19 v40.5,74.75 | U9.22 v40.5,73.25 | U9.27 v40.5,70.75 | U10.4 C62.1 v13,56.75 | R25.1 v28.12,70.62 | U6.5 v29.5,31.5 | C40.1 v22.88,32.75 | R29.1 v10.25,36 | U20.2 v10.62,50.88 | C92.1 v11.75,48.88 | C50.1 v16.88,49.5 | U14.2 v17.62,51.12 | U15.2 v9.88,74.5 | v51.62,47.88 51.67,47.92 U22.13 U22.12 | U22.15 50.38,48 v50.5,47.88 | U22.4 51.67,44.45 v51.62,44.5 | U18.5 v56,31.5 | C20.1 v49.38,32.75 | v78.12,47.88 78.17,47.92 U27.13 U27.12 | U27.15 76.88,48 v77,47.88 | U27.4 78.17,44.45 v78.12,44.5 | U24.5 v82.5,31.5 | C109.1 v75.88,32.75 | U16.5 8.05,70.83 v7.75,71.12
  Top 0.3: CN15.GND 12.8,78.95 v12.75,79
  Top 0.5: C47.1 v14.5,33.5 | C49.1 v16.12,32.5 | C38.1 v8.25,30.5 | C48.1 v6.62,31
  Top 0.75: C37.1 v33.25,66 | C25.1 v31.62,67.12 | C24.1 v24.38,67.5 | C36.1 v27.25,62.75 | v36.12,93.88 C22.1 | C26.1 v36.12,93.88 | C7.1 v32,86.62 | C23.1 v33.88,85 | U13.1 v36.12,93.88
  Top 0.8: C113.1 v15.75,39.88 | C70.1 v17.38,41 | C116.1 v9,42.38 | C69.1 v7.38,43.5
  Bottom 0.15: R45.1 v7.75,51 | C138.1 v75,69 | C139.1 79.38,69 v79,69.38 | R57.2 C2.1 R55.2 | R56.2 85.62,84.88 v85.25,85.25
  Bottom 0.25: C2.1 v85.38,81.12 | C6.1 v98.12,84.38 | C87.1 v36.5,66.75 | C78.1 v41.25,61.5 | C91.1 v42.75,61.5 | C80.1 v45.25,61.5 | C93.1 v46.5,61.62 | C94.1 v50.75,61.5 | C81.1 v53.25,61.5 | C95.1 v54.5,61.5 | C82.1 v63.5,68.75 | C96.1 v63.5,78.25 | C83.1 v63.5,80.75 | C88.1 v62.5,84.38 | C84.1 v58.75,88.5 | C85.1 v55.25,88.5 | C97.1 v54,88.5 | C98.1 v52.25,88.5 | C99.1 v48.25,88.5 | C86.1 v46.25,88.5 | C100.1 v43.75,88.5 | C76.1 v36.5,81.75 | C89.1 v36.5,75.75 | C90.1 v36.5,71.25 | C77.1 v36.5,69.75 | R39.1 v36.5,73.75 | C8.1 v91.75,80.38 | C16.1 C17.1 v7.75,71.12
  Bottom 0.5: R59.1 v5.12,15 | R59.1 v3.88,13.75 | R59.1 v5.12,12.5
  other vias: 50,75 48.5,75 48.5,73.5 50,73.5 51.5,73.5 51.5,75 51.5,76.5 50,76.5 48.5,76.5 10.62,84.5 10.62,79.25 19.62,79.25 19.62,84.5
  pour GND (rank 6): 0,0 100,0 100,99.88 0,100
INIT_DONE  (via drill 0.3)
  Top 0.25: U9.98 59.75,78.75 v59.5,79
  Bottom 0.25: v59.5,79 60,79.5 R42.2
N$1
  Top 0.15: U8.6 21.25,21.38 R5.2
  Top 0.152: R5.2 21,21.25 19.75,20 R6.1
N$2
  Top 0.15: U8.7 24.75,20.12 26.5,18.38 26.5,15.88 C13.1
  Top 0.152: U8.7 21.25,20.12 R6.2
N$3
  Top 0.25: R25.2 R24.1 25.62,67.75 U5.1
N$4
  Top 0.25: 95.62,85.25 95.62,85.08 U1.20
  Top 0.75: C3.2 95.62,85.25
N$5
  Top 0.25: U1.17 97.6,83.1 R2.2
N$6
  Top 0.152: R8.2 R7.1 38.62,8 C10.2
N$7
  Top 0.15: R8.1 R17.2
  Top 0.152: R8.1 R9.1 34.62,8 C11.2
N$8
  Top 0.152: R11.2 R10.1 28.62,8 C12.2
N$9
  Top 0.152: R16.2 R11.1 R21.1 24.62,8 C13.2
N$10
  Top 0.5: R7.2 38.62,2.02 CN1.1
N$11
  Top 0.25: XTAL1.3 C4.2 87.85,75.78 U1.10
N$12
  Top 0.25: XTAL1.1 C5.2 95.65,77.9 U1.11
N$13
  Top 0.15: U1.13 R20.2
N$14
  Top 0.25: U2.6 26.48,41.27 C28.2
  Top 0.5: C28.2 C27.2 29.38,41.25 | FB6.1 29.38,41.25 | 29.38,41.25 C55.2
N$15
  Top 0.152: R14.1 R19.2 32.62,51 32.12,50.5 32.12,48 32.38,47.75 32.38,47.5 C15.2
N$16
  Top 0.152: C14.2 32.75,43 33.5,42.25 R18.2 R12.1
N$17  (via drill 0.3)
  Top 0.15: v10.5,61.5 U10.2
  Bottom 0.15: v10.5,61.5 14,61.5 15.25,62.75 15.25,65.25 28.5,78.5 R40.1
N$18
  Top 0.25: U2.10 C30.2 28.25,52.12 C29.2
N$19
  Top 0.15: R13.1 C31.2 R12.2
N$20
  Top 0.15: R13.2 C33.1
  Top 0.152: U3.3 R13.2
N$21
  Top 0.152: U3.1 U3.2 | U3.2 C31.1 | U3.2 36,44.62 36.88,45.5 40.88,45.5 42.75,43.62 42.75,38.25 41,36.5 U6.16
N$22
  Top 0.15: R14.2 C34.2 R15.1
N$23
  Top 0.15: C32.1 R15.2
  Top 0.152: U3.5 C32.1
N$24
  Top 0.152: C34.1 U3.7 U3.6 37.25,47.5 38,46.75 41.12,46.75 44,43.88 44,28.88 42.88,27.75 U6.9
N$25
  Top 0.15: 27.77,46.02 U2.8
  Top 0.152: C15.1 28.88,47.12 27.77,46.02
N$26
  Top 0.15: U2.7 27.12,42.25 27.38,42 28,42 28.62,42.62
  Top 0.152: 28.62,42.62 28.62,43.75 29.5,44.62 29.5,44.88 C14.1
N$27
  Top 0.25: CN15.D- 15.93,77.53 arc45 16.07,77.18 16.25,77 arc-45 16.38,76.7 16.38,74.75 arc-90 15.88,74.25 15.58,74.25 arc45 15.23,74.1 14.77,73.65 arc-45 14.42,73.5 U15.4
N$28
  Top 0.25: CN15.D+ 15.12,77.58 arc45 15.27,77.23 15.73,76.77 arc-45 15.88,76.42 15.88,75 arc-90 15.62,74.75 arc-45 15.41,74.84 14.9,75.35 arc45 14.54,75.5 U15.6
N$29  (via drill 0.3)
  Top 0.25: U15.3 9.71,73.5 arc-45 9.35,73.65 8.9,74.1 arc45 8.54,74.25 6.93,74.25 arc45 v6.62,74.12 | U16.9 4.82,72.78 arc45 5.17,72.92 v5.38,73.12
  Bottom 0.25: v6.62,74.12 6.58,74.12 arc45 6.23,73.98 v5.38,73.12
N$30
  Top 0.25: FB1.2 C41.2 C1.2 U6.13
N$31
  Top 0.25: U6.12 C39.2 C42.2 FB3.2
N$32
  Top 0.25: FB4.1 C40.2 U6.4
N$33
  Top 0.15: U7.2 U7.1 38.62,18.88 38,18.25 38,14.62 C10.1
  Top 0.152: R3.1 31.75,22 36.25,22 38.12,20.12 U7.2
N$34  (via drill 0.35)
  Top 0.15: U7.3 40.75,21.38 | U6.14 36,34 34.12,32.12
  Top 0.152: 34.12,32.12 v34.12,29.88 | v35.25,28.75 35.25,24.75 38.62,21.38 U7.3
  Bottom 0.152: v34.12,29.88 v35.25,28.75
N$35
  Top 0.15: U7.6 34.38,21.25 32.38,21.25 R3.2
  Top 0.152: R4.1 31,19.88 32.25,21.12 R3.2
N$36
  Top 0.5: R21.2 24.62,1.98 CN1.7
N$37
  Top 0.5: R10.2 28.62,2.02 CN1.5
N$38
  Top 0.15: U8.2 U8.1 27.38,18.88 26.88,18.38 26.88,15.75 C12.1
  Top 0.152: U8.2 26.38,20.12 24.5,22 20.38,22 R5.1
N$39
  Top 0.15: 36.25,30.25 U6.11
  Top 0.152: U8.3 29.5,21.38 32.88,24.75 32.88,27.5 35.62,30.25 36.25,30.25
N$40
  Top 0.75: C54.2 82.63,95 TX1.1
N$41
  Top 0.25: FB5.2 C21.2 C18.2 U18.13
N$42
  Top 0.5: R9.2 34.62,1.98 CN1.3
N$43
  Top 0.15: R4.2 32.62,20.12 U7.7 36.25,20.12 37.62,18.75 37.62,14.88 36.25,13.5 C11.1
N$44
  Top 0.25: U18.12 C19.2 C51.2 FB7.2
N$45
  Top 0.25: FB8.1 C20.2 U18.4
N$46
  pour Bottom (rank 6): 84.62,88 70.5,88 70.5,100 84.62,100
N$47  (via drill 0.3)
  Top 0.15: U11.1 16.3,20.45 v16.38,20.38
  Bottom 0.15: R27.2 R26.1 v16.38,20.38
N$48
  Top 0.8: U17.3 C116.2 7.5,45.12 C69.2
  Top 1: C69.2 FB19.2
N$49
  Top 0.15: U19.2 U19.1 65,18.88 64.5,18.38 64.5,14.62 C101.1
  Top 0.152: R60.1 58.25,22 62.75,22 64.62,20.12 U19.2
N$50  (via drill 0.35)
  Top 0.15: U19.3 67.25,21.38 | U18.14 62.5,34 60.62,32.12
  Top 0.152: 60.62,32.12 v60.62,29.88 | v61.75,28.75 61.75,24.75 65.12,21.38 U19.3
  Bottom 0.152: v60.62,29.88 v61.75,28.75
N$51
  Top 0.15: U19.6 60.88,21.25 58.88,21.25 R60.2
  Top 0.152: R61.1 57.5,19.88 58.75,21.12 R60.2
N$52
  Top 0.15: R29.2 R28.1
  Top 0.25: U4.1 R28.1
N$53
  Top 0.25: U15.1 9.71,75.5 arc45 9.35,75.35 8.9,74.9 arc-45 8.54,74.75 6.5,74.75 arc90 6,74.25 6,73.28 arc90 6.5,72.78 U16.8
N$54
  Top 0.15: U16.11 1.02,71.47 R22.1
N$55
  Top 0.75: C54.1 CN2.1
N$56
  Top 0.15: U16.6 10.97,71.47 R30.2
N$57  (via drill 0.3)
  Top 0.15: U12.1 11.7,8.32 v11.75,8.38
  Bottom 0.15: v11.75,8.38 R52.1 R51.2
N$58
  Top 0.15: U21.2 U21.1 54,18.88 53.25,18.12 53.25,15.88 C103.1
  Top 0.152: U21.2 52.88,20.12 51,22 46.88,22 R62.1
N$59
  Top 0.15: 62.75,30.25 U18.11
  Top 0.152: U21.3 56,21.38 59.38,24.75 59.38,27.5 62.12,30.25 62.75,30.25
N$60
  Top 0.15: U21.6 47.75,21.38 R62.2
  Top 0.152: R62.2 47.5,21.25 46.25,20 R63.1
N$61
  Top 0.15: U21.7 51.5,20.12 52.88,18.75 52.88,15.75 C104.1
  Top 0.152: U21.7 47.75,20.12 R63.2
N$62
  Top 0.25: U22.6 52.98,41.27 C59.2
  Top 0.5: C59.2 C58.2 55.88,41.25 | FB9.1 55.88,41.25 | 55.88,41.25 C67.2
N$63
  Top 0.25: U22.10 C61.2 54.75,52.12 C60.2
N$64
  Top 0.15: R32.1 C64.2 R31.2
N$65
  Top 0.15: R32.2 C63.1
  Top 0.152: U23.3 R32.2
N$66
  Top 0.152: U23.1 U23.2 | U23.2 C64.1 | U23.2 62.5,44.62 63.38,45.5 67.38,45.5 69.25,43.62 69.25,38.25 67.5,36.5 U18.16
N$67
  Top 0.15: R33.2 C66.2 R34.1
N$68
  Top 0.15: C65.1 R34.2
  Top 0.152: U23.5 C65.1
N$69
  Top 0.152: C66.1 U23.7 U23.6 63.75,47.5 64.5,46.75 67.62,46.75 70.5,43.88 70.5,28.88 69.38,27.75 U18.9
N$70
  Top 0.5: FB18.2 C72.1 14,3.5 C111.1 U12.2
  Top 1: U12.2 U12.4
N$71
  Top 0.15: 54.27,46.02 U22.8
  Top 0.152: C106.1 55.38,47.12 54.27,46.02
N$72
  Top 0.15: U22.7 53.62,42.25 53.88,42 54.5,42 55.12,42.62
  Top 0.152: 55.12,42.62 55.12,43.75 56,44.62 56,44.88 C105.1
N$73
  Top 0.152: R50.2 R46.1 65.12,8 C101.2
N$74
  Top 0.15: R50.1 R65.2
  Top 0.152: R50.1 R47.1 61.12,8 C102.2
N$75
  Top 0.152: R58.2 R48.1 55.12,8 C103.2
N$76
  Top 0.152: R64.2 R58.1 R49.1 51.12,8 C104.2
N$77
  Top 0.5: R46.2 65.12,2.02 CN4.1
N$78
  Top 0.5: R48.2 55.12,2.02 CN4.5
N$79
  Top 0.15: R61.2 59.12,20.12 U19.7 62.38,20.12 64.12,18.38 64.12,14.75 62.88,13.5 C102.1
N$80
  Top 0.5: R49.2 51.12,1.98 CN4.7
N$81
  Top 0.5: R47.2 61.12,1.98 CN4.3
N$82
  Top 0.152: R33.1 R36.2 59.12,51 58.62,50.5 58.62,48 58.88,47.75 58.88,47.5 C106.2
N$83
  Top 0.152: C105.2 59.25,43 60,42.25 R35.2 R31.1
N$84
  Top 0.25: FB10.2 C114.2 C107.2 U24.13
N$85
  Top 0.5: U11.3 9.93,21.82 C110.2 9.75,21.75 C71.2 FB2.2
N$86
  Top 0.25: U24.12 C108.2 C115.2 FB11.2
N$87
  Top 0.25: FB12.1 C109.2 U24.4
N$88
  Top 0.15: U25.2 U25.1 91.88,18.88 91.25,18.25 91.25,14.38 C132.1
  Top 0.152: R78.1 84.75,22 89.25,22 91.12,20.12 U25.2
N$89  (via drill 0.35)
  Top 0.15: U25.3 93.75,21.38 | U24.14 89,34 87.12,32.12
  Top 0.152: 87.12,32.12 v87.12,29.88 | v88.25,28.75 88.25,24.75 91.62,21.38 U25.3
  Bottom 0.152: v87.12,29.88 v88.25,28.75
N$90
  Top 0.15: U25.6 87.38,21.25 85.38,21.25 R78.2
  Top 0.152: R79.1 84,19.88 85.25,21.12 R78.2
N$91
  Top 0.15: U26.2 U26.1 80.25,18.88 79.62,18.25 79.62,16 C134.1
  Top 0.152: U26.2 79.38,20.12 77.5,22 73.38,22 R80.1
N$92
  Top 0.15: 89.25,30.25 U24.11
  Top 0.152: U26.3 82.5,21.38 85.88,24.75 85.88,27.5 88.62,30.25 89.25,30.25
N$93
  Top 0.15: U26.6 74.25,21.38 R80.2
  Top 0.152: R80.2 74,21.25 72.75,20 R81.1
N$94
  Top 0.15: U26.7 77.38,20.12 79.25,18.25 79.25,15.62 C135.1
  Top 0.152: U26.7 74.25,20.12 R81.2
N$95
  Top 0.25: U27.6 79.47,41.27 C122.2
  Top 0.5: C122.2 C121.2 82.38,41.25 | FB13.1 82.38,41.25 | 82.38,41.25 C129.2
N$96
  Top 0.25: U27.10 C124.2 81.25,52.12 C123.2
N$97
  Top 0.15: R67.1 C126.2 R66.2
N$98
  Top 0.15: R67.2 C125.1
  Top 0.152: U28.3 R67.2
N$99
  Top 0.152: U28.1 U28.2 | U28.2 C126.1 | U28.2 89,44.62 89.88,45.5 93.88,45.5 95.75,43.62 95.75,38.25 94,36.5 U24.16
N$100
  Top 0.15: R68.2 C128.2 R69.1
N$101
  Top 0.15: C127.1 R69.2
  Top 0.152: U28.5 C127.1
N$102
  Top 0.152: C128.1 U28.7 U28.6 90.25,47.5 91,46.75 94.12,46.75 97,43.88 97,28.88 95.88,27.75 U24.9
N$103
  Top 0.15: 80.78,46.02 U27.8
  Top 0.152: C137.1 81.88,47.12 80.78,46.02
N$104
  Top 0.15: U27.7 80.12,42.25 80.38,42 81,42 81.62,42.62
  Top 0.152: 81.62,42.62 81.62,43.75 82.5,44.62 82.5,44.88 C136.1
N$105
  Top 0.152: R76.2 R72.1 91.62,8 C132.2
N$106
  Top 0.15: R76.1 R83.2
  Top 0.152: R76.1 R73.1 87.62,8 C133.2
N$107
  Top 0.152: R77.2 R74.1 81.62,8 C134.2
N$108
  Top 0.152: R82.2 R77.1 R75.1 77.62,8 C135.2
N$109
  Top 0.5: R72.2 91.62,2.02 CN9.1
N$110
  Top 0.5: R74.2 81.62,2.02 CN9.5
N$111
  Top 0.15: R79.2 85.62,20.12 U25.7 88.75,20.12 90.88,18 90.88,14.38 90,13.5 C133.1
N$112
  Top 0.5: R75.2 77.62,1.98 CN9.7
N$113
  Top 0.5: R73.2 87.62,1.98 CN9.3
N$114
  Top 0.152: R68.1 R71.2 85.62,51 85.12,50.5 85.12,48 85.38,47.75 85.38,47.5 C137.2
N$115
  Top 0.152: C136.2 85.75,43 86.5,42.25 R70.2 R66.1
NCE  (via drill 0.3)
  Top 0.25: v40.5,74 40.25,73.75 R39.2
  Bottom 0.25: R39.2 40.25,73.75 v40.5,74
NCONFIG  (via drill 0.3)
  Top 0.25: v40.5,77.25 R38.2
  Bottom 0.25: R38.2 v40.5,77.25
NCSO
  Top 0.15: 14.25,68.5 14.88,69.12 18.75,69.12 29.88,80.25 U9.8
  Top 0.152: 14.25,68.5 13.75,68 13.75,63.5 12.75,62.5 10.5,62.5 9.25,61.25 U10.1
NSTATUS  (via drill 0.3)
  Top 0.25: R37.2 v40.5,79.75
  Bottom 0.25: v40.5,79.75 R37.2
PGA0_!CS
  Top 0.15: U6.2 29.38,35.25 29.62,35.5 29.62,36.62 29.12,37.12 22.38,37.12 21.25,38.25 21.25,52.62 25,56.38 39.5,56.38 43.75,60.62 U9.42
PGA1_!CS
  Top 0.15: U18.2 55.62,35.25 55.88,35.5 55.88,36.88 55.62,37.12 50.12,37.12 47.62,39.62 47.62,56.88 47.38,57.12 47.38,57.62 48,58.12 48,59.5 48.75,60.25 U9.52
PGA2_!CS
  Top 0.15: U24.2 82.12,35.25 82.38,35.5 82.38,36.88 82.12,37.12 75.5,37.12 74.25,38.38 74.25,54 71.38,56.88 59.25,56.88 59,57.12 59,58.12 56.75,60.38 U9.68
PGA_!MUTE  (via drill 0.3)
  Top 0.15: U6.8 25.88,27.75 21.62,32 21.62,36.88 20.5,38 20.5,52.88 24.75,57.12 38.62,57.12 | U24.8 79,27.75 73.5,33.25 73.5,53.75 71.12,56.12 58.5,56.12 v58.38,56.25 | U18.8 51.75,27.75 46.88,32.62 46.88,55.88 v46.25,56.5 | 38.62,57.12 39.12,57.62 39.75,57.62 41.75,59.62 U9.38 | 38.62,57.12 v38.5,57.38
  Bottom 0.15: v58.38,56.25 58,56.62 48.38,56.62 48.25,56.5 v46.25,56.5 46.25,56.62 38.75,56.62 38.5,56.88 v38.5,57.38
PGA_SCLK  (via drill 0.3)
  Top 0.15: U6.6 23.88,30.25 22,32.12 22,37 20.88,38.12 20.88,52.75 24.88,56.75 39.38,56.75 | U24.6 77,30.25 73.88,33.38 73.88,53.88 71.25,56.5 58.88,56.5 v58.5,56.88 | U18.6 49.75,30.25 47.25,32.75 47.25,56.62 v46.88,57 | 39.38,56.75 42.25,59.62 U9.39 | 39.38,56.75 v39.38,57.12
  Bottom 0.15: v58.5,56.88 58.38,57 48.25,57 48.12,56.88 47,56.88 v46.88,57 39.5,57 v39.38,57.12
PGA_SDI  (via drill 0.3)
  Top 0.15: U6.3 29.25,34 30,34.75 30,36.75 29.25,37.5 22.5,37.5 21.62,38.38 21.62,52.5 25.12,56 40.12,56 41.44,57.31 | U24.3 82.12,34 82.75,34.62 82.75,37.12 82.38,37.5 75.62,37.5 74.62,38.5 74.62,54.12 71.5,57.25 59.62,57.25 v59.5,57.38 | U18.3 55.75,34 56.25,34.5 56.25,37 55.75,37.5 50.25,37.5 48,39.75 48,57.25 v47.88,57.38 | 41.44,57.31 44.25,60.12 U9.43 | v41.38,57.5 41.44,57.31
  Bottom 0.15: v59.5,57.38 v47.88,57.38 47.75,57.5 46.5,57.5 46.38,57.38 41.5,57.38 v41.38,57.5
RL_MAINS_ON  (via drill 0.3)
  Top 0.15: U9.28 v34.75,70.25
  Bottom 0.15: v34.75,70.25 30.5,70.25 20.5,60.25 10.25,60.25 6.25,64.25 CN12.2
SPDIF_IN
  Top 0.75: R1.2 95.62,91.83 arc45 95.33,92.54 TX1.6
  Top 0.8: C3.1 R1.2
STM_NRST
  Top 0.15: U29.4 74.97,70.72 75.25,71 75.25,73.62 74.25,74.62 74.25,77.69 CN11.3 75.75,79.36 R84.2
STM_SPI_MISO
  Top 0.15: U29.12 83.6,67.47 U30.2
STM_SPI_MOSI
  Top 0.15: U30.5 87.88,65 84.75,68.12 U29.13 78.12,68.12 75.62,65.62 69,65.62 62.88,71.75 U9.84
STM_SPI_SCLK  (via drill 0.3)
  Top 0.15: v86.38,65.62 82.53,65.62 81.33,66.83 U29.11 77.33,66.83 75.75,65.25 68.88,65.25 62.88,71.25 U9.83 | v87.5,66.25 U30.6
  Bottom 0.15: v86.38,65.62 86.88,65.62 v87.5,66.25
STM_SWCLK
  Top 0.15: U29.20 77.2,72.67 75.83,74.04 CN11.4
STM_SWDIO
  Top 0.15: U29.19 77.35,72.03 74.62,74.75 74.62,77.38 75.25,78 77.11,78 CN11.5
STM_UART_RX  (via drill 0.3)
  Top 0.15: U29.9 71.28,67.47 70,68.75 70,77.88 v69.88,78 | U16.1 12.47,68.22 14.38,70.12 17.32,70.12 18.45,71.25 v18.5,71.25
  Bottom 0.15: v69.88,78 69.88,83.5 56.38,97 34.25,97 22.5,85.25 22.5,76.25 18.5,72.25 v18.5,71.25
STM_UART_TX  (via drill 0.3)
  Top 0.15: U29.8 71.12,68.12 70.38,68.88 v70.38,79 | U16.4 13.93,70.17 14.25,70.5 17.25,70.5 17.62,70.88 17.62,71.88 v17.8,72.05
  Bottom 0.15: v70.38,79 70.38,83.5 56.5,97.38 34.12,97.38 22.12,85.38 22.12,76.38 v17.8,72.05
TCLK
  Top 0.15: CN3.1 6.62,52.27 6.62,54.5 7.88,55.75 13.75,55.75 14.88,56.88 14.88,63.75 27.38,76.25 U9.16
  Bottom 0.15: R45.2 4.32,49.88 CN3.1
TDI
  Top 0.15: CN3.5 8.22,56.12 13.62,56.12 14.5,57 14.5,63.88 27.38,76.75 U9.15
  Bottom 0.15: R43.1 4.32,60.12 CN3.5
TDO  (via drill 0.3)
  Top 0.15: v7.12,52.5 7,52.62 7,53.25 8.75,55 14,55 15.62,56.62 15.62,63.5 26.38,74.25 U9.20
  Bottom 0.15: v7.12,52.5 4.31,52.5 CN3.2
TMS  (via drill 0.3)
  Top 0.15: v8,55 8.38,55.38 13.88,55.38 15.25,56.75 15.25,63.62 26.88,75.25 U9.18
  Bottom 0.15: CN3.3 v8,55 R44.1
V+
  Top 0.5: U4.3 C38.2 6.75,33.12 C48.2
  Top 0.75: C36.2 25.75,64.75 C24.2 U5.3
  Top 1: FB2.1 6.12,26.25 4.88,27.5 4.88,33.75 2.5,36.12 CN6.1 | CN6.2 CN6.1 | FB19.1 3,42 CN6.2 | CN6.2 2.5,46 3.25,46.75 17.38,46.75 19,48.38 19,54.12 25.75,60.88 C36.2 | 6.75,33.12 6.75,36 5.25,37.5 CN6.1
  Bottom 0.5: CN12.1 6.75,63 9,60.75 9,47 4.5,42.5 CN6.2
V-
  Top 1: CN8.2 CN8.1 2.5,12.25 9.62,5.12 FB18.1
WM_CLKOUT
  Top 0.15: U9.91 65.12,75.25 72.25,82.38 82.62,82.38 85.15,79.85 U1.9
WM_GPO0  (via drill 0.3)
  Top 0.15: U9.114 56.25,88.25 57.88,89.88 65.25,89.88 70.88,84.25 85.62,84.25 85.78,84.4 U1.2
  Top 0.152: U1.2 89.22,84.4 v89.25,84.38
  Bottom 0.152: v89.25,84.38 88.75,84.88 R56.1
WM_I2S_BCLK  (via drill 0.3)
  Top 0.15: U1.14 94.78,81.15 v94,80.38 | v65.12,74.25 U9.89
  Bottom 0.15: v94,80.38 93.5,79.88 93.5,76.75 91.25,74.5 67.12,74.5 66.25,73.62 65.75,73.62 v65.12,74.25
WM_I2S_DATA  (via drill 0.3)
  Top 0.15: U1.12 94.6,79.85 v94,79.25 | v65.12,73.25 U9.87
  Bottom 0.15: v94,79.25 94,76.75 91.38,74.12 67.25,74.12 66.38,73.25 v65.12,73.25
WM_I2S_LRCLK  (via drill 0.3)
  Top 0.15: U1.15 94.42,81.8 v94,81.38 | v66.12,74.25 65.62,73.75 U9.88
  Bottom 0.15: v94,81.38 93.12,80.5 93.12,76.88 91.12,74.88 66.75,74.88 v66.12,74.25
WM_I2S_SCLK  (via drill 0.3)
  Top 0.15: U1.16 94.08,82.45 v94,82.38 | v65.62,74.75 U9.90
  Bottom 0.15: v94,82.38 92.75,81.12 92.75,77 91,75.25 66.12,75.25 v65.62,74.75
WM_RST
  Top 0.15: U9.110 58.25,87.12 58.5,87.38 65.75,87.38 70.38,82.75 85.25,82.75 86.2,81.8 U1.6
WM_SPI_CSB  (via drill 0.3)
  Top 0.15: U9.111 57.75,87.12 58.38,87.75 65.88,87.75 70.5,83.12 85.38,83.12 86.05,82.45 U1.5
  Top 0.152: U1.5 89.17,82.45 v89.25,82.38
  Bottom 0.152: v89.25,82.38 R55.1
WM_SPI_SCLK  (via drill 0.3)
  Top 0.15: U1.1 85.8,85.05 85.38,84.62 71.5,84.62 v71.38,84.75 | v71.38,82.25 66.12,82.25 64,80.12 63,80.12 62.62,79.75 U9.100
  Top 0.152: U1.1 89.17,85.05 v89.25,85.12
  Bottom 0.15: v71.38,84.75 v71.38,82.25
  Bottom 0.152: v89.25,85.12 89.25,85.62 88.75,86.12 R54.1
WM_SPI_SDIN  (via drill 0.35)
  Top 0.15: U9.113 56.75,88.25 58,89.5 65.12,89.5 70.75,83.88 85.62,83.88 85.75,83.75 U1.3
  Top 0.152: U1.3 89.5,83.75 89.88,83.38 v89.88,79.88
  Bottom 0.152: R57.1 v89.88,79.88
WM_SPI_SDOUT  (via drill 0.3)
  Top 0.15: U9.112 57.25,88.25 58,89 65.12,89 70.62,83.5 85.5,83.5 85.9,83.1 U1.4
  Top 0.152: U1.4 89.22,83.1 v89.25,83.12
  Bottom 0.152: v89.25,83.12 88.75,83.62 R53.1

## Text on the board
Bottom: 016-005-MAIN-B